# EAGLE design KramerMC_BS1k_ferryTALE2020 (EAGLE 6.6.0)

## Sheet 1 of 2: BWS
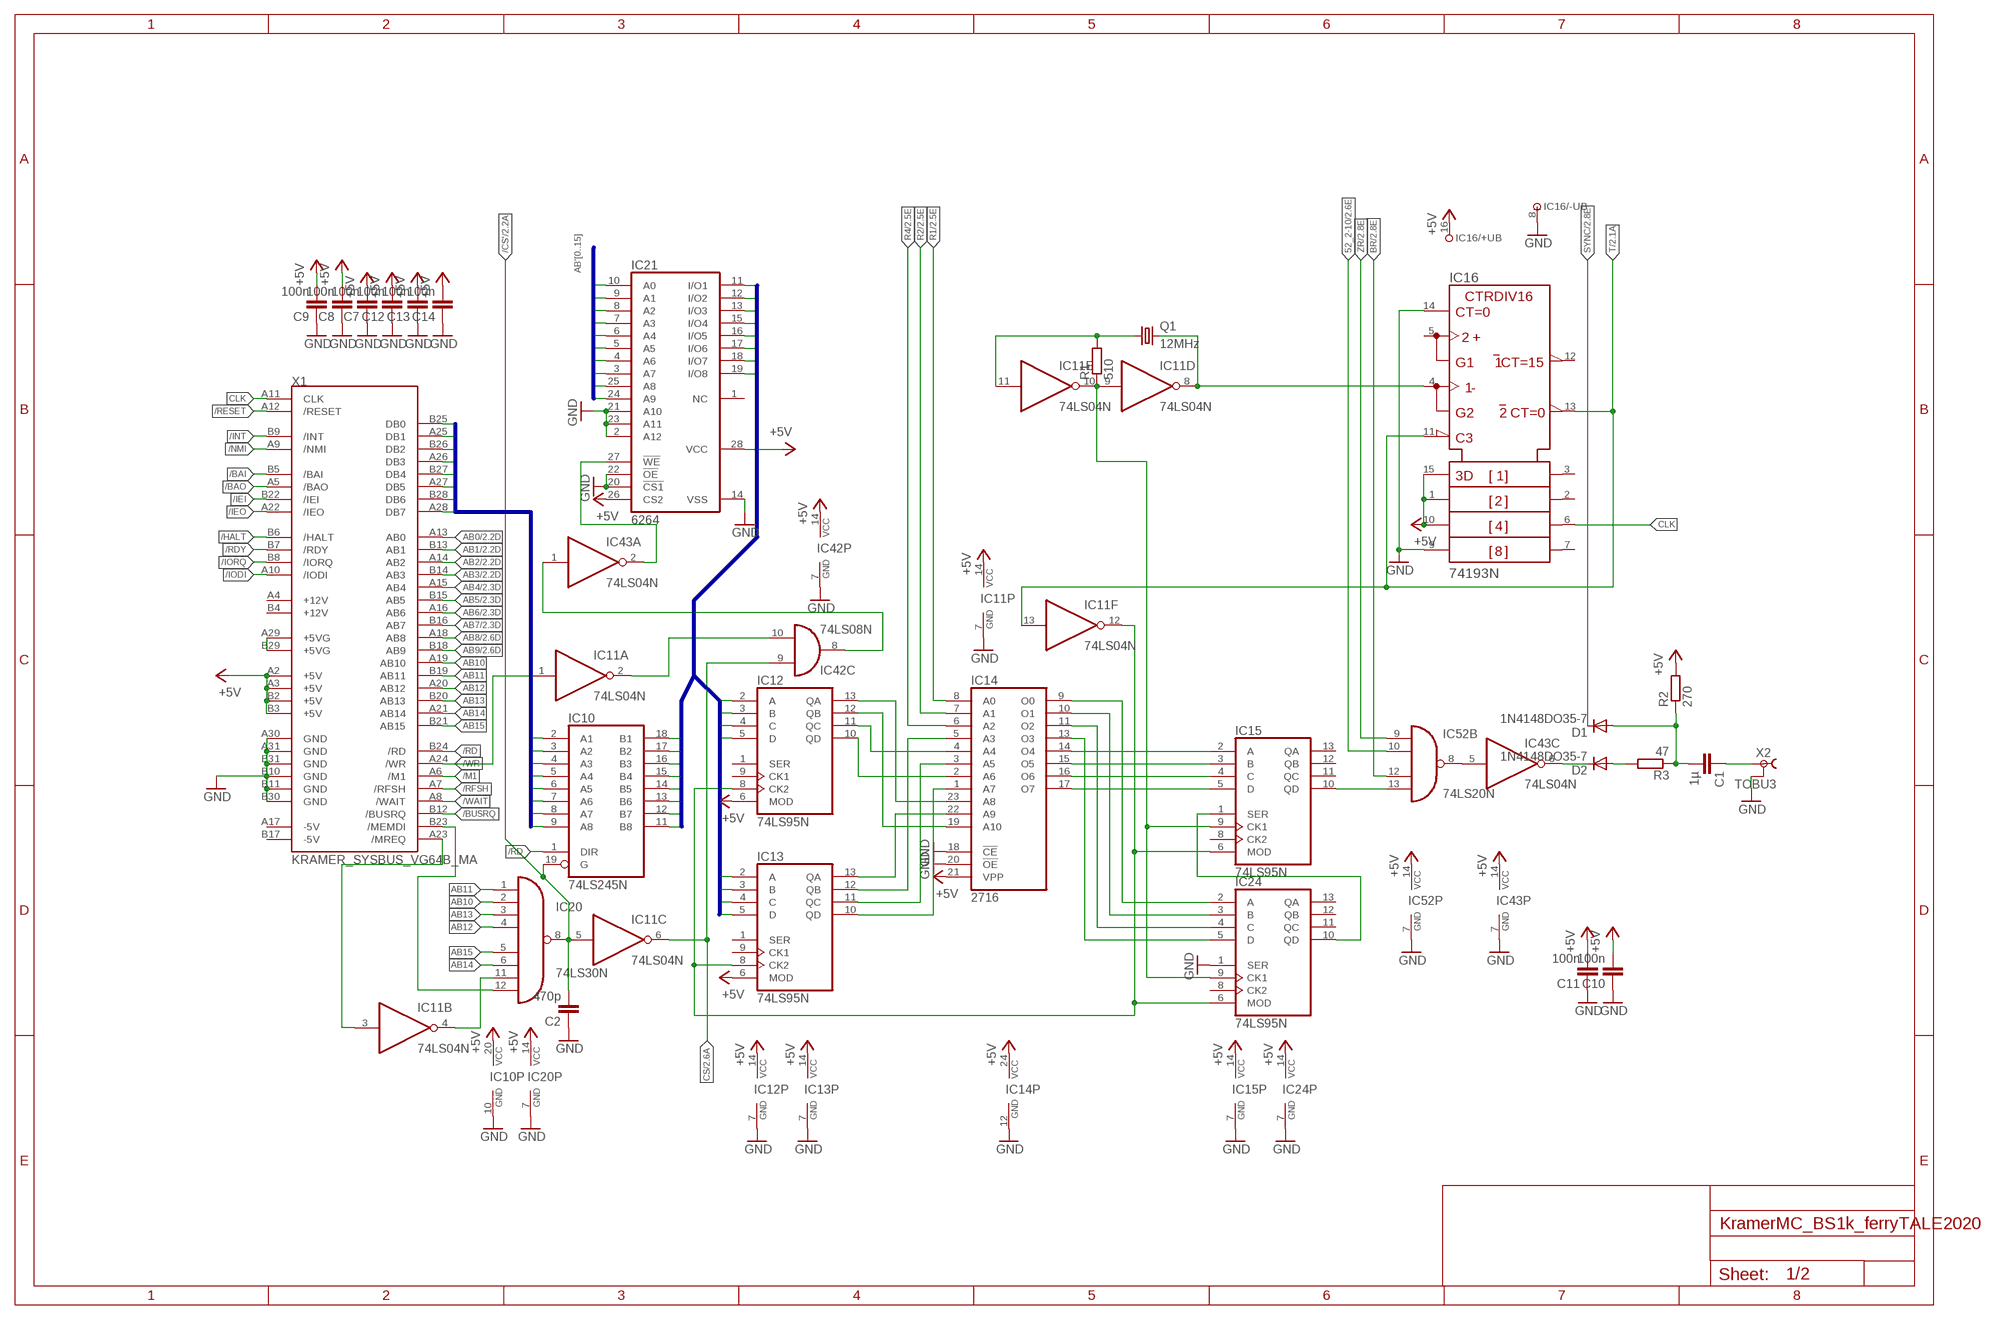
[diagram p0: schematic, sheet 1]

### Parts
C1  1µ  C-EUC0805_WIDE  [C0805_WIDE]
C2  470p  C-EUC0805_WIDE  [C0805_WIDE]
C7  100n  C-EU050-024X044  [C050-024X044]
C8  100n  C-EU050-024X044  [C050-024X044]
C9  100n  C-EU050-024X044  [C050-024X044]
C10  100n  C-EU050-024X044  [C050-024X044]
C11  100n  C-EU050-024X044  [C050-024X044]
C12  100n  C-EU050-024X044  [C050-024X044]
C13  100n  C-EU050-024X044  [C050-024X044]
C14  100n  C-EU050-024X044  [C050-024X044]
D1  1N4148DO35-7  [DO35-7]
D2  1N4148DO35-7  [DO35-7]
IC10  74LS245N  [DIL20]
IC11  74LS04N  [DIL14]
IC12  74LS95N  [DIL14]
IC13  74LS95N  [DIL14]
IC14  2716  [DIL24]
IC15  74LS95N  [DIL14]
IC16  74193N  [DIL16]
IC20  74LS30N  [DIL14]
IC21  6264  6264A  [DIL28-6]
IC24  74LS95N  [DIL14]
IC42  74LS08N  [DIL14]
IC43  74LS04N  [DIL14]
IC52  74LS20N  [DIL14]
Q1  12MHz  CRYSTALHC49S  [HC49/S]
R1  510  R-EU_R0805_WIDE  [R0805_WIDE]
R2  270  R-EU_0207/10  [0207/10]
R3  47  R-EU_0207/2V  [0207/2V]
X1  KRAMER_SYSBUS_VG64B_MA  [MAB64]
X2  TOBU3  [TOBU3]

### Nets
52_2-10: IC52.10(B:I1) ; also sheet 2
+5V: C7.2 C8.2 C9.2 C10.2 C11.2 C12.2 C13.2 C14.2 IC10.20(VCC) IC11.14(P:VCC) IC12.6(MOD) IC12.14(VCC) IC13.6(MOD) IC13.14(VCC) IC14.21(VPP) IC14.24(VCC) IC15.14(VCC) IC16.1(B) IC16.10(C) IC16.15(A) IC16.16(+UB) IC20.14(VCC) IC21.26(CS2) IC21.28(VCC) IC24.14(VCC) IC42.14(P:VCC) IC43.14(P:VCC) IC52.14(P:VCC) R2.2 X1.A2(+5V) X1.A3(+5V) X1.B2(+5V) X1.B3(+5V) ; also sheet 2
+5VG: X1.A29(+5VG) X1.B29(+5VG)
/BAI: X1.B5(/BAI)
/BAO: X1.A5(/BAO)
/BUSRQ: X1.B12(/BUSRQ)
/CS': C2.2 IC10.19(G) IC11.5(C:I) IC20.8(O) ; also sheet 2
/HALT: X1.B6(/HALT)
/IEI: X1.B22(/IEI)
/IEO: X1.A22(/IEO)
/INT: X1.B9(/INT)
/IODI: X1.A10(/IODI)
/IORQ: X1.B8(/IORQ)
/M1: X1.A6(/M1)
/MEMDI: IC20.12(I7) X1.B23(/MEMDI)
/MREQ: IC11.3(B:I) X1.A23(/MREQ)
/NMI: X1.A9(/NMI)
/RD: IC10.1(DIR) X1.B24(/RD)
/RDY: X1.B7(/RDY)
/RESET: X1.A12(/RESET)
/RFSH: X1.A7(/RFSH)
/WAIT: X1.A8(/WAIT)
/WR: IC11.1(A:I) X1.A24(/WR)
AB0: X1.A13(AB0) ; also sheet 2
AB1: X1.B13(AB1) ; also sheet 2
AB2: X1.A14(AB2) ; also sheet 2
AB3: X1.B14(AB3) ; also sheet 2
AB4: X1.A15(AB4) ; also sheet 2
AB5: X1.B15(AB5) ; also sheet 2
AB6: X1.A16(AB6) ; also sheet 2
AB7: X1.B16(AB7) ; also sheet 2
AB8: X1.A18(AB8) ; also sheet 2
AB9: X1.B18(AB9) ; also sheet 2
AB10: IC20.2(I1) X1.A19(AB10)
AB11: IC20.1(I0) X1.B19(AB11)
AB12: IC20.4(I3) X1.A20(AB12)
AB13: IC20.3(I2) X1.B20(AB13)
AB14: IC20.6(I5) X1.A21(AB14)
AB15: IC20.5(I4) X1.B21(AB15)
AB'0: IC21.10(A0) ; also sheet 2
AB'1: IC21.9(A1) ; also sheet 2
AB'2: IC21.8(A2) ; also sheet 2
AB'3: IC21.7(A3) ; also sheet 2
AB'4: IC21.6(A4) ; also sheet 2
AB'5: IC21.5(A5) ; also sheet 2
AB'6: IC21.4(A6) ; also sheet 2
AB'7: IC21.3(A7) ; also sheet 2
AB'8: IC21.25(A8) ; also sheet 2
AB'9: IC21.24(A9) ; also sheet 2
BR: IC52.12(B:I2) ; also sheet 2
CLK: IC16.6(QC) X1.A11(CLK)
CS: IC11.6(C:O) IC42.9(C:I0) ; also sheet 2
DB0: IC10.9(A8) X1.B25(DB0)
DB1: IC10.8(A7) X1.A25(DB1)
DB2: IC10.7(A6) X1.B26(DB2)
DB3: IC10.6(A5) X1.A26(DB3)
DB4: IC10.5(A4) X1.B27(DB4)
DB5: IC10.4(A3) X1.A27(DB5)
DB6: IC10.3(A2) X1.B28(DB6)
DB7: IC10.2(A1) X1.A28(DB7)
DB'0: IC10.11(B8) IC13.3(B) IC21.11(I/O1)
DB'1: IC10.12(B7) IC12.4(C) IC21.12(I/O2)
DB'2: IC10.13(B6) IC13.4(C) IC21.13(I/O3)
DB'3: IC10.14(B5) IC12.5(D) IC21.15(I/O4)
DB'4: IC10.15(B4) IC13.5(D) IC21.16(I/O5)
DB'5: IC10.16(B3) IC12.2(A) IC21.17(I/O6)
DB'6: IC10.17(B2) IC13.2(A) IC21.18(I/O7)
DB'7: IC10.18(B1) IC12.3(B) IC21.19(I/O8)
GND: C2.1 C7.1 C8.1 C9.1 C10.1 C11.1 C12.1 C13.1 C14.1 IC10.10(GND) IC11.7(P:GND) IC12.7(GND) IC13.7(GND) IC14.12(GND) IC14.18(!CE) IC14.20(!OE) IC15.7(GND) IC16.8(-UB) IC16.9(D) IC16.14(CLR) IC20.7(GND) IC21.2(A12) IC21.14(VSS) IC21.20(!CS1) IC21.21(A10) IC21.22(!OE) IC21.23(A11) IC24.1(SER) IC24.7(GND) IC42.7(P:GND) IC43.7(P:GND) IC52.7(P:GND) X1.A30(GND) X1.A31(GND) X1.B10(GND) X1.B11(GND) X1.B30(GND) X1.B31(GND) X2.2 X2.2@1 X2.2@2 ; also sheet 2
N$1: IC11.9(D:I) IC11.10(E:O) IC15.9(CK1) IC24.9(CK1) R1.1
N$2: IC11.11(E:I) Q1.1 R1.2
N$3: IC11.8(D:O) IC16.4(DOWN) Q1.2
N$4: IC12.13(QA) IC14.23(A8)
N$5: IC12.12(QB) IC14.19(A10)
N$6: IC12.11(QC) IC14.4(A4)
N$7: IC12.10(QD) IC14.2(A6)
N$8: IC13.13(QA) IC14.22(A9)
N$9: IC13.12(QB) IC14.5(A3)
N$10: IC13.11(QC) IC14.3(A5)
N$11: IC13.10(QD) IC14.1(A7)
N$12: IC14.17(O7) IC15.5(D)
N$13: IC11.2(A:O) IC42.10(C:I1)
N$14: IC42.8(C:O) IC43.1(A:I)
N$15: IC21.27(!WE) IC43.2(A:O)
N$16: IC14.16(O6) IC15.4(C)
N$17: IC14.15(O5) IC15.3(B)
N$18: IC11.4(B:O) IC20.11(I6)
N$19: IC14.14(O4) IC15.2(A)
N$20: IC43.5(C:I) IC52.8(B:O)
N$21: IC14.13(O3) IC24.5(D)
N$22: IC14.11(O2) IC24.4(C)
N$23: IC14.10(O1) IC24.3(B)
N$24: IC14.9(O0) IC24.2(A)
N$25: IC15.1(SER) IC24.10(QD)
N$27: IC11.12(F:O) IC12.8(CK2) IC13.8(CK2) IC15.6(MOD) IC24.6(MOD)
N$28: C1.2 D1.A R2.1 R3.1
N$29: IC15.10(QD) IC52.13(B:I3)
N$30: C1.1 X2.1
N$31: D2.A R3.2
N$32: D2.C IC43.6(C:O)
R1: IC14.8(A0) ; also sheet 2
R2: IC14.7(A1) ; also sheet 2
R4: IC14.6(A2) ; also sheet 2
SYNC: D1.C ; also sheet 2
T: IC11.13(F:I) IC16.11(!LOAD) IC16.13(!BO) ; also sheet 2
ZR: IC52.9(B:I0) ; also sheet 2
Unconnected: IC12.1(SER) IC12.9(CK1) IC13.1(SER) IC13.9(CK1) IC15.8(CK2) IC15.11(QC) IC15.12(QB) IC15.13(QA) IC16.2(QB) IC16.3(QA) IC16.5(UP) IC16.7(QD) IC16.12(!CO) IC21.1(NC) IC24.8(CK2) IC24.11(QC) IC24.12(QB) IC24.13(QA) X1.A4(+12V) X1.A17(-5V) X1.B4(+12V) X1.B17(-5V)

### Buses
DB[0..7]
DB'[0..7]
AB'[0..15]

## Sheet 2 of 2: Zeitbasis
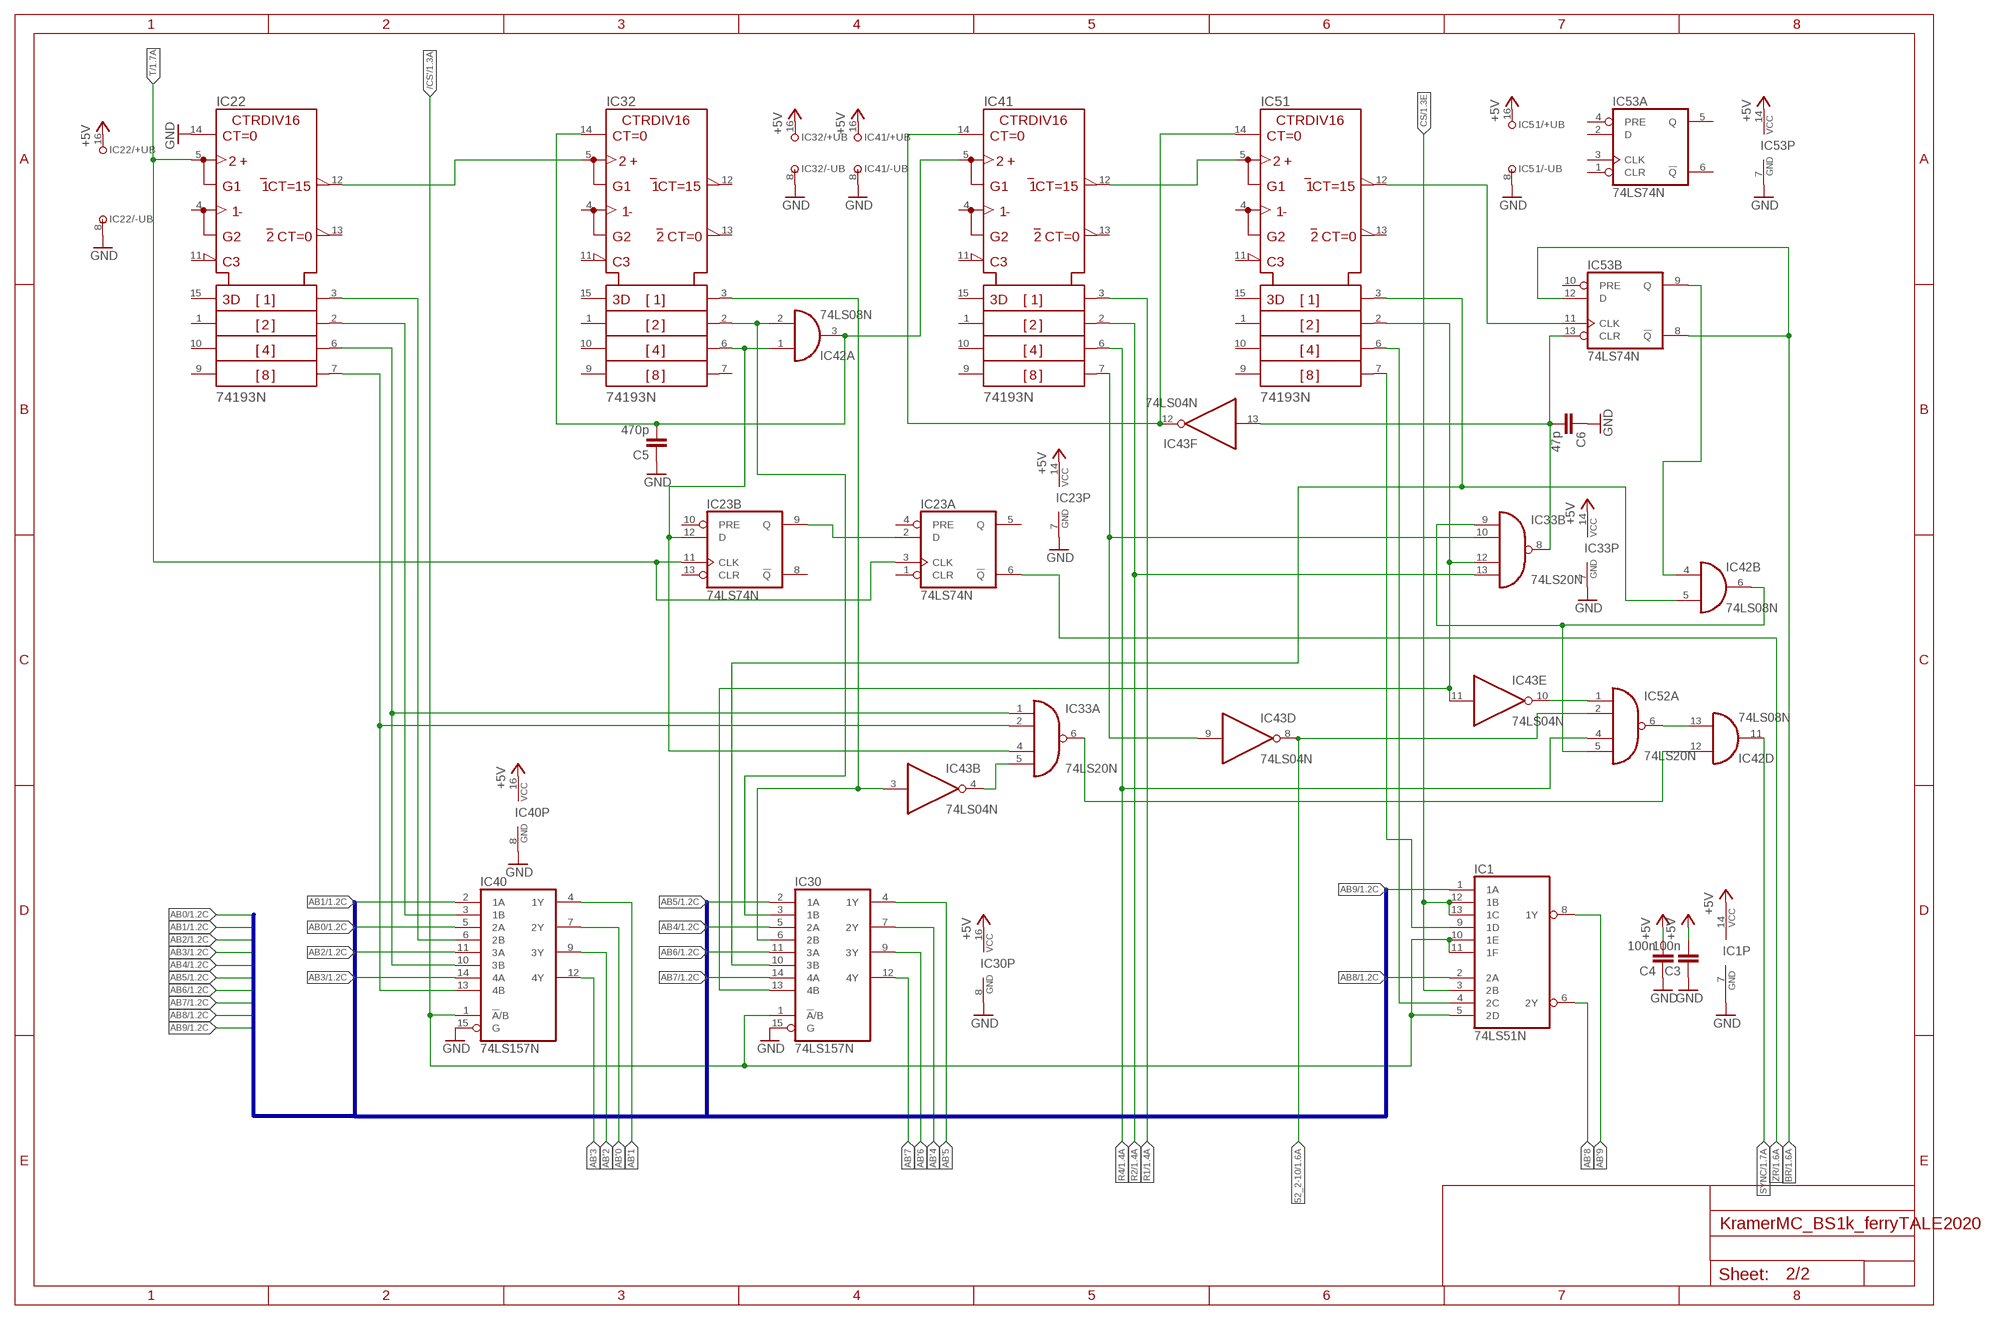
[diagram p1: schematic, sheet 2]

### Parts
C3  100n  C-EU050-024X044  [C050-024X044]
C4  100n  C-EU050-024X044  [C050-024X044]
C5  470p  C-EU050-024X044  [C050-024X044]
C6  47p  C-EU050-024X044  [C050-024X044]
IC1  74LS51N  [DIL14]
IC22  74193N  [DIL16]
IC23  74LS74N  [DIL14]
IC30  74LS157N  [DIL16]
IC32  74193N  [DIL16]
IC33  74LS20N  [DIL14]
IC40  74LS157N  [DIL16]
IC41  74193N  [DIL16]
IC51  74193N  [DIL16]
IC53  74LS74N  [DIL14]

### Nets
52_2-10: IC43.8(D:O) IC52.2(A:I1) ; also sheet 1
+5V: C3.2 C4.2 IC1.14(VCC) IC22.16(+UB) IC23.14(P:VCC) IC30.16(VCC) IC32.16(+UB) IC33.14(P:VCC) IC40.16(VCC) IC41.16(+UB) IC51.16(+UB) IC53.14(P:VCC) ; also sheet 1
/CS': IC1.5(2D) IC1.10(1E) IC1.11(1F) IC30.1(!A!/B) IC40.1(!A!/B) ; also sheet 1
AB0: IC40.5(2A) ; also sheet 1
AB1: IC40.2(1A) ; also sheet 1
AB2: IC40.11(3A) ; also sheet 1
AB3: IC40.14(4A) ; also sheet 1
AB4: IC30.5(2A) ; also sheet 1
AB5: IC30.2(1A) ; also sheet 1
AB6: IC30.11(3A) ; also sheet 1
AB7: IC30.14(4A) ; also sheet 1
AB8: IC1.2(2A) ; also sheet 1
AB9: IC1.1(1A) ; also sheet 1
AB'0: IC40.7(2Y) ; also sheet 1
AB'1: IC40.4(1Y) ; also sheet 1
AB'2: IC40.9(3Y) ; also sheet 1
AB'3: IC40.12(4Y) ; also sheet 1
AB'4: IC30.7(2Y) ; also sheet 1
AB'5: IC30.4(1Y) ; also sheet 1
AB'6: IC30.9(3Y) ; also sheet 1
AB'7: IC30.12(4Y) ; also sheet 1
AB'8: IC1.6(2Y) ; also sheet 1
AB'9: IC1.8(1Y) ; also sheet 1
BR: IC53.8(B:!Q) IC53.12(B:D) ; also sheet 1
CS: IC1.3(2B) IC1.12(1B) IC1.13(1C) ; also sheet 1
GND: C3.1 C4.1 C5.1 C6.1 IC1.7(GND) IC22.8(-UB) IC22.14(CLR) IC23.7(P:GND) IC30.8(GND) IC30.15(G) IC32.8(-UB) IC33.7(P:GND) IC40.8(GND) IC40.15(G) IC41.8(-UB) IC51.8(-UB) IC53.7(P:GND) ; also sheet 1
N$26: IC22.3(QA) IC40.6(2B)
N$33: IC22.2(QB) IC40.3(1B)
N$34: IC22.6(QC) IC33.1(A:I0) IC40.10(3B)
N$35: IC22.7(QD) IC33.2(A:I1) IC40.13(4B)
N$36: IC22.12(!CO) IC32.5(UP)
N$37: C5.2 IC32.14(CLR) IC41.5(UP) IC42.3(A:O)
N$38: IC23.12(B:D) IC32.6(QC) IC33.4(A:I2) IC42.1(A:I0)
N$39: IC30.3(1B) IC32.2(QB) IC42.2(A:I1)
N$40: IC30.6(2B) IC32.3(QA) IC43.3(B:I)
N$41: IC33.5(A:I3) IC43.4(B:O)
N$42: IC23.2(A:D) IC23.9(B:Q)
N$43: IC41.12(!CO) IC51.5(UP)
N$44: IC41.14(CLR) IC43.12(F:O) IC51.14(CLR)
N$45: C6.2 IC33.8(B:O) IC43.13(F:I) IC53.13(B:CLR)
N$46: IC33.10(B:I1) IC41.7(QD) IC43.9(D:I)
N$47: IC33.9(B:I0) IC42.6(B:O) IC52.5(A:I3)
N$48: IC51.12(!CO) IC53.11(B:CLK)
N$49: IC30.10(3B) IC42.5(B:I1) IC51.3(QA)
N$51: IC30.13(4B) IC33.12(B:I2) IC43.11(E:I) IC51.2(QB)
N$52: IC42.4(B:I0) IC53.9(B:Q)
N$53: IC1.4(2C) IC51.6(QC)
N$54: IC1.9(1D) IC51.7(QD)
N$55: IC42.13(D:I1) IC52.6(A:O)
N$56: IC43.10(E:O) IC52.1(A:I0)
N$57: IC33.6(A:O) IC42.12(D:I0)
R1: IC41.3(QA) ; also sheet 1
R2: IC33.13(B:I3) IC41.2(QB) ; also sheet 1
R4: IC41.6(QC) IC52.4(A:I2) ; also sheet 1
SYNC: IC42.11(D:O) ; also sheet 1
T: IC22.5(UP) IC23.3(A:CLK) IC23.11(B:CLK) ; also sheet 1
ZR: IC23.6(A:!Q) ; also sheet 1
Unconnected: IC22.1(B) IC22.4(DOWN) IC22.9(D) IC22.10(C) IC22.11(!LOAD) IC22.13(!BO) IC22.15(A) IC23.1(A:CLR) IC23.4(A:PRE) IC23.5(A:Q) IC23.8(B:!Q) IC23.10(B:PRE) IC23.13(B:CLR) IC32.1(B) IC32.4(DOWN) IC32.7(QD) IC32.9(D) IC32.10(C) IC32.11(!LOAD) IC32.12(!CO) IC32.13(!BO) IC32.15(A) IC41.1(B) IC41.4(DOWN) IC41.9(D) IC41.10(C) IC41.11(!LOAD) IC41.13(!BO) IC41.15(A) IC51.1(B) IC51.4(DOWN) IC51.9(D) IC51.10(C) IC51.11(!LOAD) IC51.13(!BO) IC51.15(A) IC53.1(A:CLR) IC53.2(A:D) IC53.3(A:CLK) IC53.4(A:PRE) IC53.5(A:Q) IC53.6(A:!Q) IC53.10(B:PRE)

### Buses
AB[0..15]

## Library data of the parts
C1-C14 = rcl:C-EU: CAPACITOR, European symbol
D1 D2 = diode:1N4148: DIODE high speed (Philips)
IC1 = 74xx-us:74*51: AND-OR-INVERT gates/for S-type see 74S51 <DEVICE:74S51>
IC10 = 74xx-eu:74*245: Octal BUS TRANSCEIVER, 3-state
IC11 IC43 = 74xx-eu:74*04: Hex INVERTER
IC12 IC13 IC15 IC24 = 74xx-eu:74*95: 4-bit parallel access SHIFT REGISTER
IC14 = memory:2716: MEMORY
IC16 IC22 IC32 IC41 IC51 = 74ttl-din:74*193: Synchronus 4-bit up down COUNTER
IC20 = 74xx-eu:74*30: 8-input NAND gate
IC21 = memory-hitachi:6264A: MEMORY; OC_FARNELL: 283605; OC_NEWARK: unknown
IC23 IC53 = 74xx-eu:74*74: Dual D type positive edge triggered FLIP FLOP, preset and clear
IC30 IC40 = 74xx-eu:74*157: Quadruple 2-line to 1-line data SELECTOR/MULTIPLEXER
IC33 IC52 = 74xx-eu:74*20: Dual 4-input NAND gate
IC42 = 74xx-eu:74*08: Quad 2-input AND gate
Q1 = crystal:CRYSTAL: CRYSTAL; OC_FARNELL: 1667008; OC_NEWARK: unknown
R1-R3 = rcl:R-EU_: RESISTOR, European symbol
X1 = ferry_Kramer_KC:KRAMER_SYSBUS: Kramer Kleincomputer System-Bus Buchse (auf den Modulen verwenden)
X2 = con-hirschmann:TOBU3: Female Cinch CONNECTOR ( RCA Jack ); MF: FARNELL; MPN: TOBU 3; OC_FARNELL: 592791; OC_NEWARK: 06WX5914

## Board
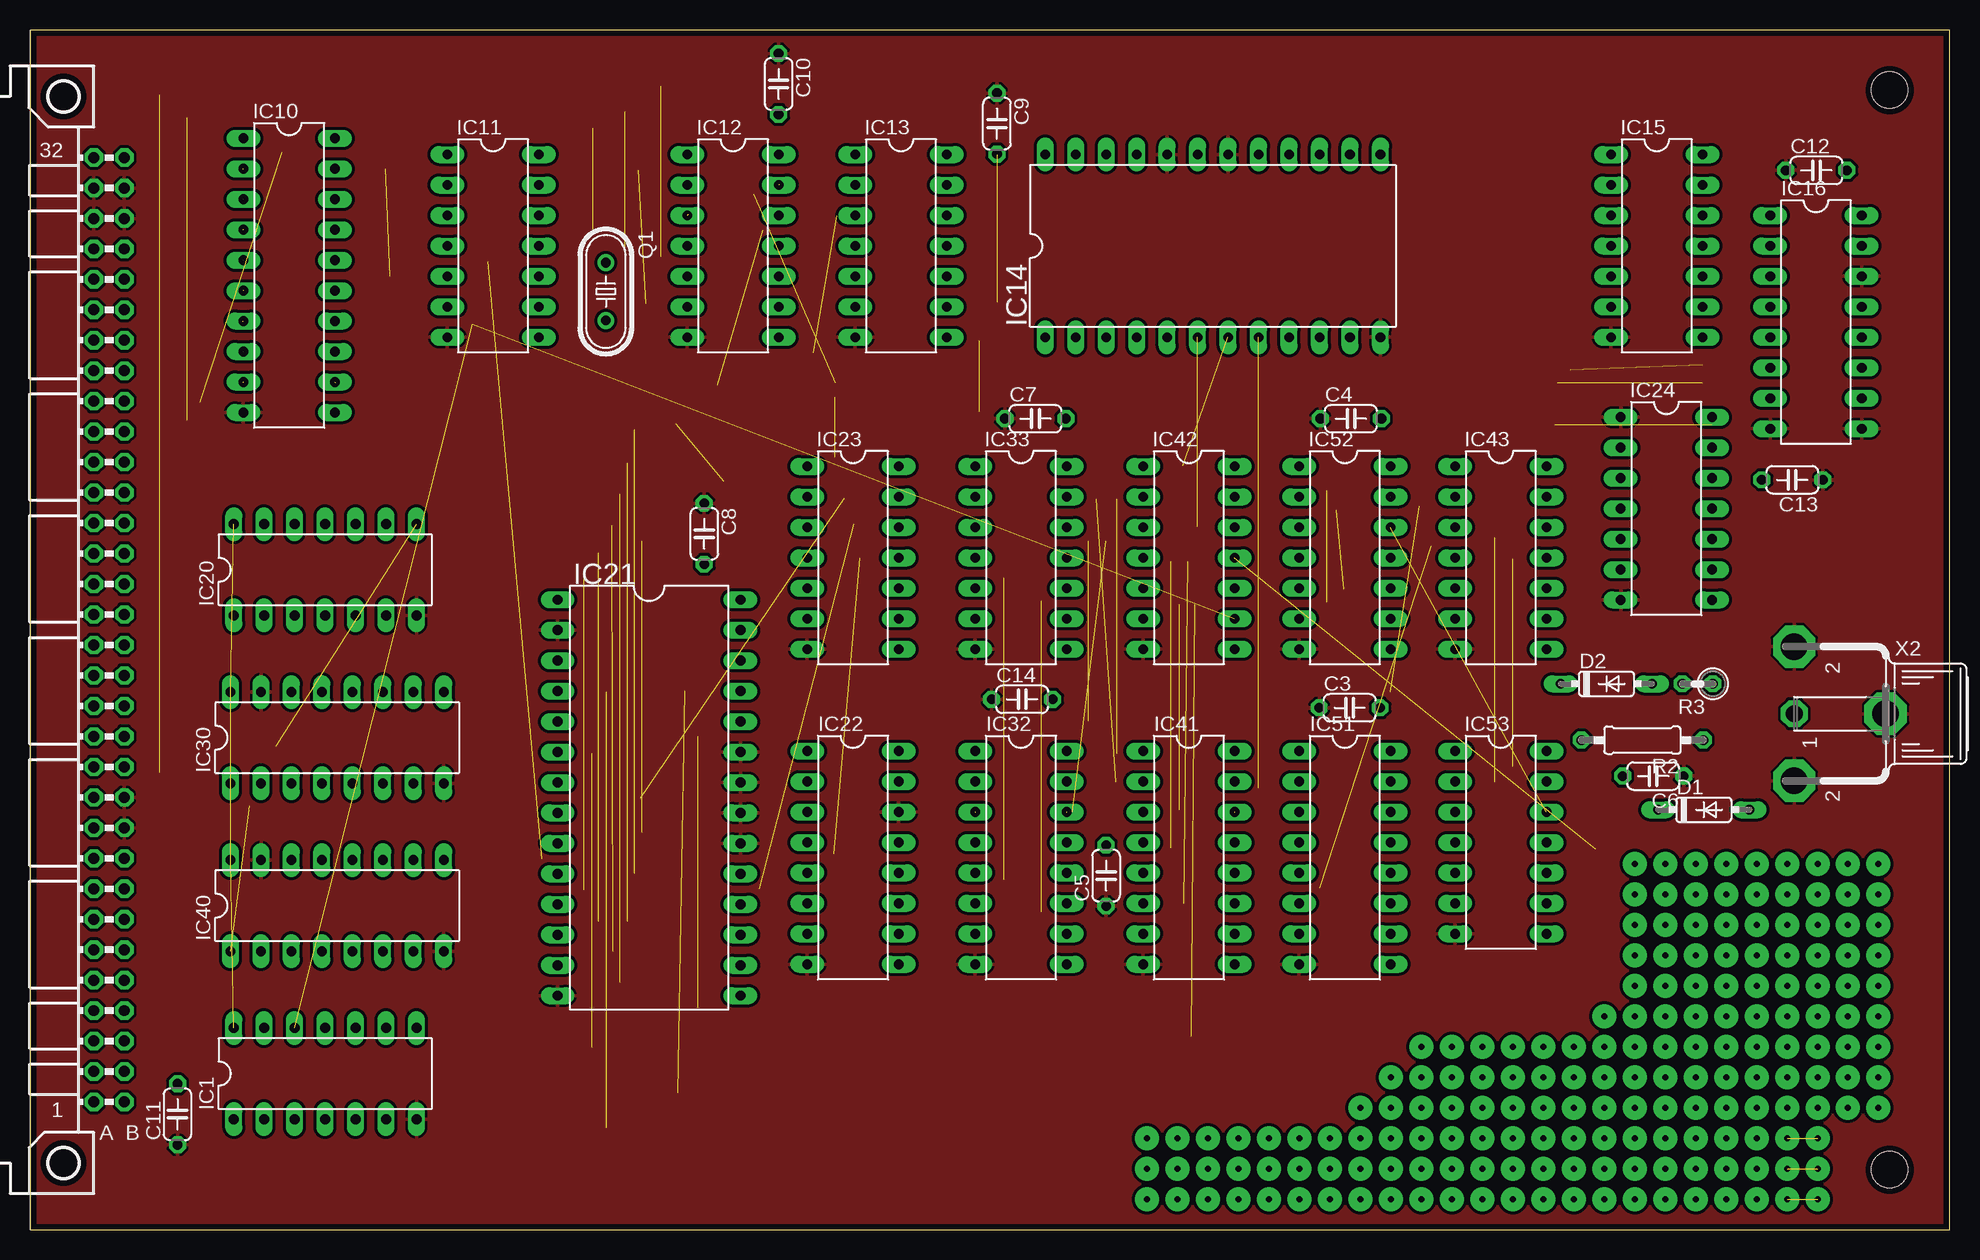
[diagram p2: board, top side]
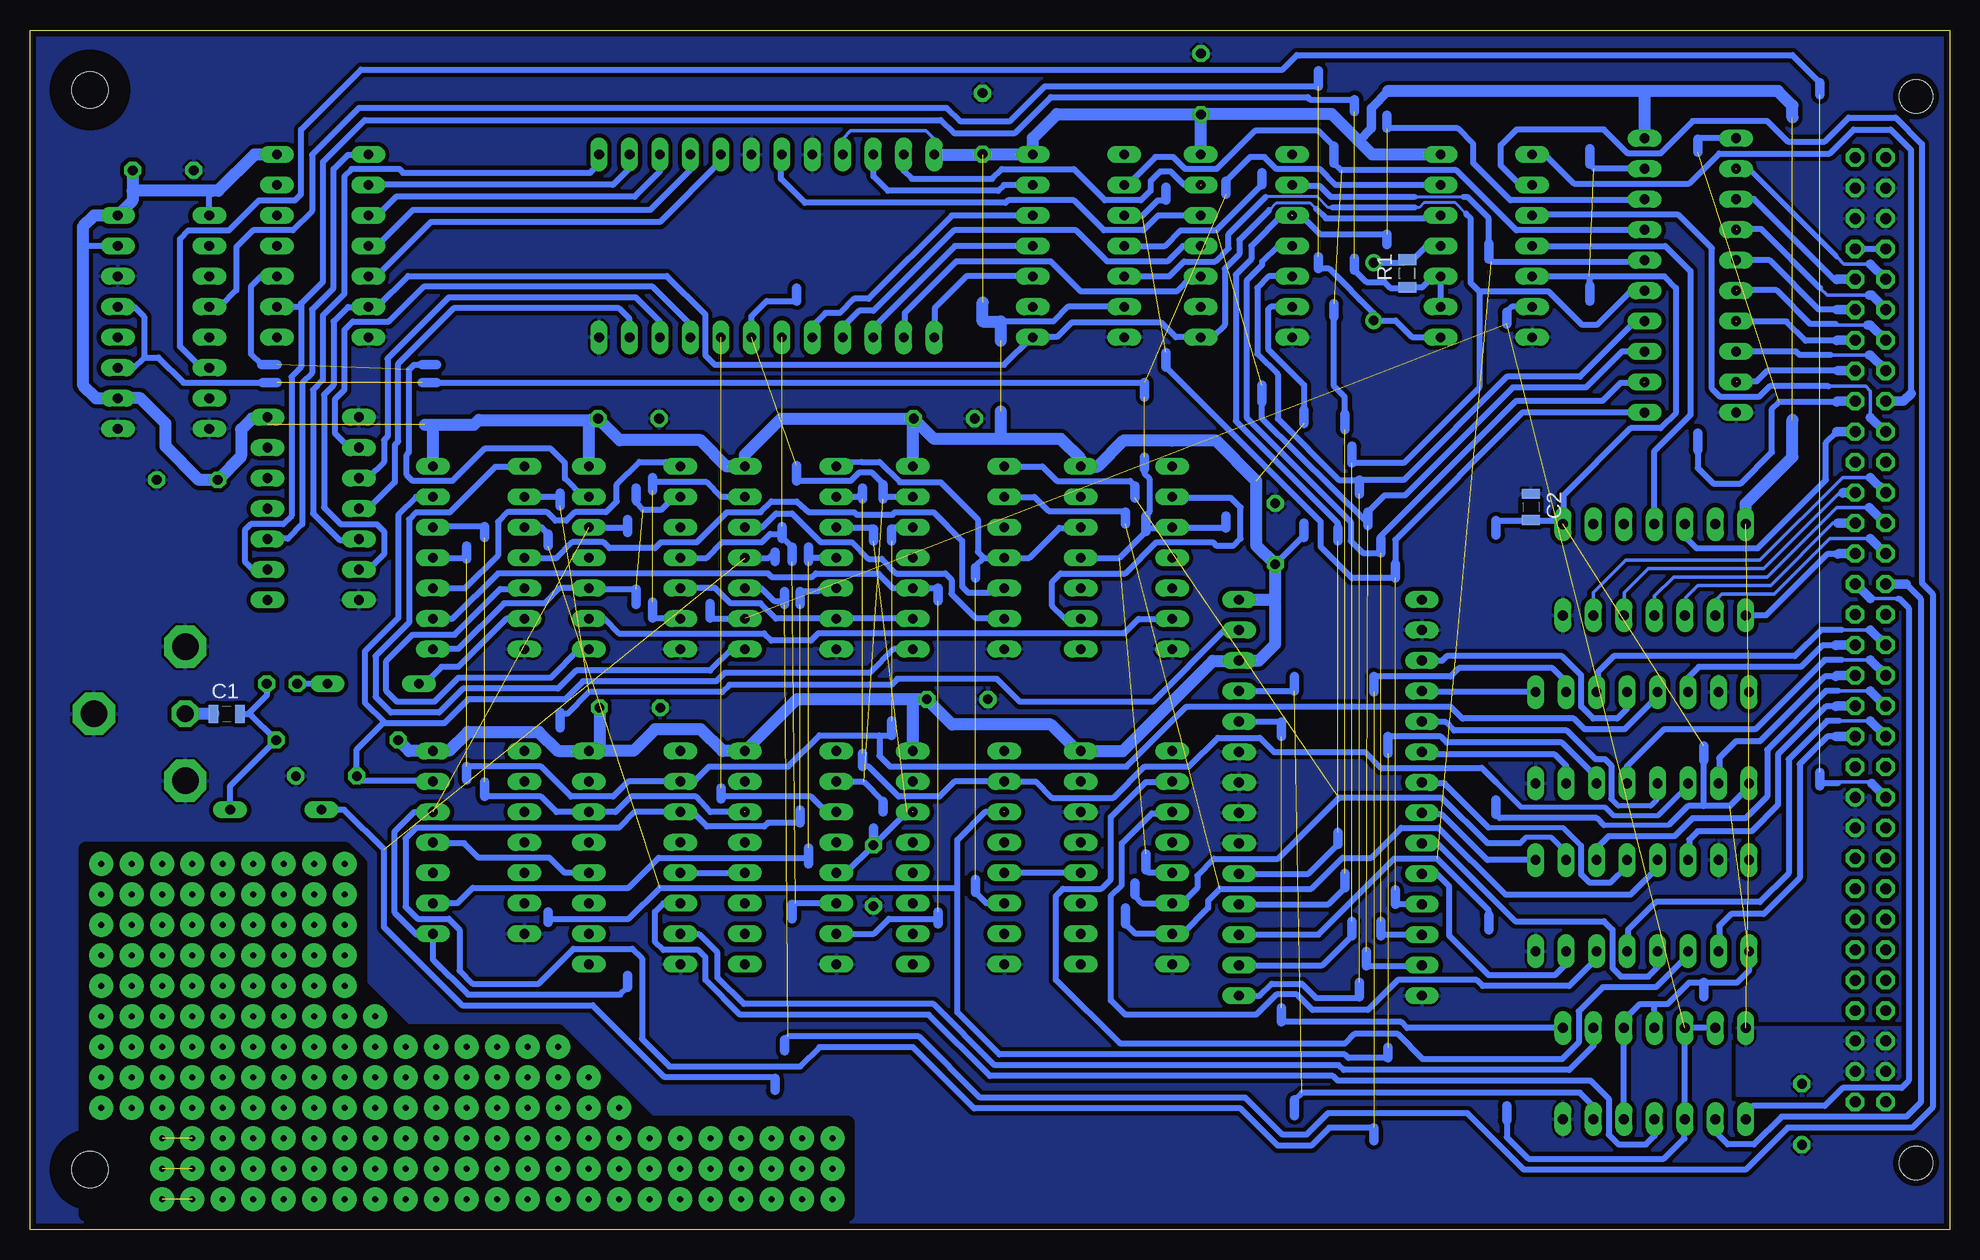
[diagram p3: board, bottom side, seen from below]

Size 160 x 100 mm. Coordinates in mm from the lower left corner, seen from the top.
Outline: 0,0 160,0 160,100 0,100 0,0
Copper layers (1*16): Top 0.035mm / dielectric 1.5mm / Bottom 0.035mm
Design rules "ferry_home *": minimum track width 0.15mm, minimum drill 0.3mm, track to track 0.25mm, track to pad 0.25mm, pad to pad 0.25mm, via to via 0.25mm, smd to smd 0.25mm, copper to edge 0.5mm, drill to drill 0.2mm, minimum pad ring 0.3mm, minimum via ring 0.3mm, stop-mask expansion 0.075mm, vias tented up to drill 0mil, thermal gap 0.2mm
Holes 3 mm at 155,95 155,5
bRestrict: area 152,92 to 158,98; area 152,2 to 158,8; area 91.8,1.3 to 155.3,31.8

### Footprints (pad centres in the part's own frame; a part is rotated, then mirrored left to right if it is on the bottom)
C0805_WIDE = smd 0.8 x 1.5: 1 -1.1,0; 2 1.1,0
C050-024X044 = drill 0.813 octagon: 1 -2.54,0; 2 2.54,0
DO35-7 = drill 0.813 long: A 3.81,0; C -3.81,0
DIL14 = drill 0.813 long: 1 -7.62,-3.81; 2 -5.08,-3.81; 3 -2.54,-3.81; 4 0,-3.81; 5 2.54,-3.81; 6 5.08,-3.81; 7 7.62,-3.81; 8 7.62,3.81; 9 5.08,3.81; 10 2.54,3.81; 11 0,3.81; 12 -2.54,3.81; 13 -5.08,3.81; 14 -7.62,3.81
DIL20 = drill 0.813 long: 1 -11.43,-3.81; 2 -8.89,-3.81; 3 -6.35,-3.81; 4 -3.81,-3.81; 5 -1.27,-3.81; 6 1.27,-3.81; 7 3.81,-3.81; 8 6.35,-3.81; 9 8.89,-3.81; 10 11.43,-3.81; 11 11.43,3.81; 12 8.89,3.81; 13 6.35,3.81; 14 3.81,3.81; 15 1.27,3.81; 16 -1.27,3.81; 17 -3.81,3.81; 18 -6.35,3.81; 19 -8.89,3.81; 20 -11.43,3.81
DIL24 = drill 0.813 long: 1 -13.97,-7.62; 2 -11.43,-7.62; 3 -8.89,-7.62; 4 -6.35,-7.62; 5 -3.81,-7.62; 6 -1.27,-7.62; 7 1.27,-7.62; 8 3.81,-7.62; 9 6.35,-7.62; 10 8.89,-7.62; 11 11.43,-7.62; 12 13.97,-7.62; 13 13.97,7.62; 14 11.43,7.62; 15 8.89,7.62; 16 6.35,7.62; 17 3.81,7.62; 18 1.27,7.62; 19 -1.27,7.62; 20 -3.81,7.62; 21 -6.35,7.62; 22 -8.89,7.62; 23 -11.43,7.62; 24 -13.97,7.62
DIL16 = drill 0.813 long: 1 -8.89,-3.81; 2 -6.35,-3.81; 3 -3.81,-3.81; 4 -1.27,-3.81; 5 1.27,-3.81; 6 3.81,-3.81; 7 6.35,-3.81; 8 8.89,-3.81; 9 8.89,3.81; 10 6.35,3.81; 11 3.81,3.81; 12 1.27,3.81; 13 -1.27,3.81; 14 -3.81,3.81; 15 -6.35,3.81; 16 -8.89,3.81
DIL28-6 = drill 0.813 long: 1 -16.51,-7.62; 2 -13.97,-7.62; 3 -11.43,-7.62; 4 -8.89,-7.62; 5 -6.35,-7.62; 6 -3.81,-7.62; 7 -1.27,-7.62; 8 1.27,-7.62; 9 3.81,-7.62; 10 6.35,-7.62; 11 8.89,-7.62; 12 11.43,-7.62; 13 13.97,-7.62; 14 16.51,-7.62; 15 16.51,7.62; 16 13.97,7.62; 17 11.43,7.62; 18 8.89,7.62; 19 6.35,7.62; 20 3.81,7.62; 21 1.27,7.62; 22 -1.27,7.62; 23 -3.81,7.62; 24 -6.35,7.62; 25 -8.89,7.62; 26 -11.43,7.62; 27 -13.97,7.62; 28 -16.51,7.62
HC49/S = drill 0.813: 1 -2.413,0; 2 2.413,0
R0805_WIDE = smd 0.9 x 1.5: 1 -1.15,0; 2 1.15,0
0207/10 = drill 0.813 octagon: 1 -5.08,0; 2 5.08,0
0207/2V = drill 0.813 octagon: 1 -1.27,0; 2 1.27,0
MAB64 = drill 0.914 octagon: A1 39.37,-1.27; A2 36.83,-1.27; A3 34.29,-1.27; A4 31.75,-1.27; A5 29.21,-1.27; A6 26.67,-1.27; A7 24.13,-1.27; A8 21.59,-1.27; A9 19.05,-1.27; A10 16.51,-1.27; A11 13.97,-1.27; A12 11.43,-1.27; A13 8.89,-1.27; A14 6.35,-1.27; A15 3.81,-1.27; A16 1.27,-1.27; A17 -1.27,-1.27; A18 -3.81,-1.27; A19 -6.35,-1.27; A20 -8.89,-1.27; A21 -11.43,-1.27; A22 -13.97,-1.27; A23 -16.51,-1.27; A24 -19.05,-1.27; A25 -21.59,-1.27; A26 -24.13,-1.27; A27 -26.67,-1.27; A28 -29.21,-1.27; A29 -31.75,-1.27; A30 -34.29,-1.27; A31 -36.83,-1.27; A32 -39.37,-1.27; B1 39.37,1.27; B2 36.83,1.27; B3 34.29,1.27; B4 31.75,1.27; B5 29.21,1.27; B6 26.67,1.27; B7 24.13,1.27; B8 21.59,1.27; B9 19.05,1.27; B10 16.51,1.27; B11 13.97,1.27; B12 11.43,1.27; B13 8.89,1.27; B14 6.35,1.27; B15 3.81,1.27; B16 1.27,1.27; B17 -1.27,1.27; B18 -3.81,1.27; B19 -6.35,1.27; B20 -8.89,1.27; B21 -11.43,1.27; B22 -13.97,1.27; B23 -16.51,1.27; B24 -19.05,1.27; B25 -21.59,1.27; B26 -24.13,1.27; B27 -26.67,1.27; B28 -29.21,1.27; B29 -31.75,1.27; B30 -34.29,1.27; B31 -36.83,1.27; B32 -39.37,1.27 | hole 2.794: 44.45,-3.81; -44.45,-3.81
TOBU3 = drill 1.397 octagon: 1 0,-2.54 | drill 2.21 octagon: 2 5.588,-2.54; 2@1 -5.588,-2.54; 2@2 0,5.08

### Placement (x,y rotation side)
C1  143.6,43 0 bottom
C2  34.89,60.25 270 bottom
C3  110,43.5 0 top
C4  110.1,67.6 0 top
C5  89.7,29.5 90 top
C6  135.3,37.8 180 top
C7  83.8,67.6 0 top
C8  56.2,58 270 top
C9  80.6,92.2 270 top
C10  62.4,95.5 270 top
C11  12.3,9.6 90 top
C12  148.9,88.3 0 top
C13  146.9,62.5 180 top
C14  82.7,44.2 0 top
D1  139.51,35 0 top
D2  131.4,45.5 0 top
IC1  24.6,13 0 top
IC10  21.6,79.54 270 top
IC11  38.6,82 270 top
IC12  58.6,82 270 top
IC13  72.6,82 270 top
IC14  98.6,82 0 top
IC15  135.6,82 270 top
IC16  148.87,75.65 270 top
IC20  24.6,55 0 top
IC21  51.6,36 270 top
IC22  68.6,31 270 top
IC23  68.6,56 270 top
IC24  136.4,60.1 270 top
IC30  25.6,41 0 top
IC32  82.6,31 270 top
IC33  82.6,56 270 top
IC40  25.6,27 0 top
IC41  96.6,31 270 top
IC42  96.6,56 270 top
IC43  122.6,56 270 top
IC51  109.6,31 270 top
IC52  109.6,56 270 top
IC53  122.6,32.27 270 top
Q1  48,78.2 270 top
R1  45.2,79.7 90 bottom
R2  134.4,40.8 180 top
R3  139,45.5 180 top
X1  6.6,50 270 top
X2  149.6,43 270 top

### Tracks (layer width: path | path; a pad name or v marks a point on that pad's centre or on a via)
52_2-10  (1 unrouted)
  Bottom 0.5: IC43.8 126.39,48.4 124.3,48.4 120.5,52.2 117.1,52.2 115.84,53.46 IC52.10 113.26,53.46 113.2,53.4 109.5,53.4 | IC52.2 106.32,61.08 107.4,60 108.9,60 109.5,60.6 109.5,60.8
  Bottom 0.8: 109.5,53.4 109.5,52.1 | 109.5,60.8 109.5,61.8
+5V  (8 unrouted)
  Bottom 0: IC24.14 140.21,67.11 140.2,67.1
  Bottom 0.3: IC14.21 92.25,90.95 91.6,91.6 85.3,91.6 84.6,90.9 84.6,89.65 IC14.24
  Bottom 0.5: IC21.28 | IC13.6 73.48,76.92 74.7,75.7 79.1,75.7 | IC12.6 56.58,76.92 56.8,76.7 56.8,73.4 53.8,70.4 53.8,68.3 | 53.8,57.7 53.96,57.7 C8.2 | 25.41,94.81 25.5,94.9 | IC16.1 145.06,86.34 144.8,86.6 | IC16.15 155.5,82 155.6,82.1 | 64.79,65.49 65.1,65.8
  Bottom 0.8: 53.8,67.2 53.8,68.3 | 53.8,58.9 53.8,57.7 | 46.8,94.9 48.2,93.5 48.2,91.8 49.25,90.75
  Bottom 1: IC12.14 62.41,92.73 C10.2 | IC14.24 80.62,89.62 C9.2 80.58,89.62 IC13.14 76.41,90.99 74.4,93 62.44,93 C10.2 | C10.2 62.34,93 51.5,93 49.25,90.75 48.12,89.62 IC11.14 | 113.3,67.5 122.6,67.5 123,67.1 126.4,67.1 | 113.3,67.5 112.74,67.5 C4.2 110.84,65.8 104.1,65.8 101.92,63.62 IC42.14 100.41,64.59 97.4,67.6 C7.2 | IC52.14 113.41,67.39 113.3,67.5 | C12.2 151.44,86.6 | 151.44,86.6 151.44,85.78 IC16.16 154.66,84.54 155.6,83.6 155.6,82.1 155.6,70.4 154.5,69.3 IC16.10 150.8,69.3 148.7,67.2 148.7,65.3 145.9,62.5 C13.2 142.4,64.46 142.4,66.7 141.48,67.62 IC24.14 | IC15.14 141.28,89.62 144.3,86.6 144.8,86.6 151.44,86.6 | 86.1,44.2 C14.2 83.14,42.1 74.9,42.1 72.69,39.89 IC22.16 68.91,39.89 61.4,47.4 59.25,47.4 IC21.26 57.57,47.43 56.2,48.8 56.2,52.21 56.5,52.51 | 86.1,44.2 96.1,44.2 IC41.16 102.29,39.89 104.1,41.7 107.9,41.7 109.7,39.9 112.5,39.9 | IC32.16 86.41,43.89 86.1,44.2 | IC33.14 86.41,67.53 C7.2 | 79.1,65.9 74.1,65.9 72.41,64.21 IC23.14 70.98,63.62 68.8,65.8 65.1,65.8 61.2,65.8 57.8,62.4 57.8,57.06 C8.2 56.2,54.2 56.19,52.51 56.5,52.51 | 79.1,65.9 84.64,65.9 C7.2 | IC21.28 56.5,52.51 | 112.5,39.9 IC51.16 116,39.9 117.6,41.5 123.5,41.5 125.1,39.9 IC53.14 128.41,39.89 R2.2 | C3.2 112.54,39.94 112.5,39.9 | 13.1,67.5 13.1,64.4 16.98,60.52 IC20.14 | 13.1,92.7 13.1,93.7 14.3,94.9 25.1,94.9 | 25.1,94.9 25.5,94.9 46.8,94.9 | 80.6,77.3 80.6,75.7 79.1,75.7 79.1,74.1 | 79.1,68.2 79.1,65.9 | 127.1,67.1 126.4,67.1 | IC43.14 126.41,67.09 126.4,67.1 | IC10.20 25.41,94.59 25.1,94.9
  pour Bottom (isolate 0.35, rank 5): 2.2,11.2 2.2,16.8 17.7,16.8 17.7,11.2
+5VG
  Bottom 0.5: X1.A29 X1.B29
/CS'  (3 unrouted)
  Bottom 0.4: 23.3,33.8 23.4,33.7 28.8,33.7
  Bottom 0.5: IC11.5 30.03,79.46 | 30.03,79.46 23.76,79.46 22.8,78.5 22.8,68.12 22.79,68.11 24.1,66.8 26.6,66.8 32.2,61.2 32.2,58.83 IC20.8 32.51,59.1 35.1,59.1 37.8,59.1 | 24.7,18.8 25.8,18.8 27.14,17.46 IC1.10 IC1.5 | 24.7,18.8 23.5,18.8 21.7,20.6 20.5,20.6 17.7,20.6 16.7,21.6 IC40.1 | IC30.1 16.71,36.89 18.3,35.3 20.5,35.3 | 20.5,35.3 21.8,35.3 23.3,33.8 | 28.8,33.7 29.4,34.3 37.5,34.3 37.8,34.6 | 20.5,35.3 20.5,39.1 | IC10.19 29.63,88.43 30,88.8 | 30.03,79.46 30.03,78.73 30,78.7 | IC1.11 24.6,18.7 24.7,18.8
  Bottom 0.8: 37.8,34.6 37.8,35.8 | 37.8,57.9 37.8,59.1 | C2.2 35.05,59.15 35.1,59.1 | 20.5,39.1 20.5,40.3 | 20.5,19.4 20.5,20.6 | 30,88.8 30,90.1 | 30,78.7 30,77.4
/MEMDI
  Bottom 0.5: IC20.12 22.06,57.76 21.1,56.8 16,56.8 10.3,62.5 10.3,65.6 9.4,66.5
  Bottom 0.8: X1.B23 9.39,66.51 9.4,66.5
/MREQ
  Bottom 0.3: 6.6,67.7 6.6,69.9 7,70.3 10.1,70.3
  Bottom 0.5: 10.1,70.3 15,70.3 15.9,69.4 19.1,69.4 19.8,70.1 19.8,81.8 22.6,84.6 34.73,84.6 IC11.3
  Bottom 0.8: X1.A23 5.41,66.51 6.6,67.7
/RD  (1 unrouted)
  Bottom 0.5: 9.4,69 14.2,69 14.8,68.4 14.8,64.8 17.4,62.2 19.7,62.2 21,63.5 21,65 | IC10.1 20.93,90.97 21,90.9
  Bottom 0.8: X1.B24 9.35,69.05 9.4,69 | 21,90.9 21,89.8 | 21,66.4 21,65
/WR
  Bottom 0.5: 3.2,69.7 3.2,90 4.9,91.7 8,91.7 10,89.7 19.2,89.7 21.7,87.2 31.3,87.2 33.6,89.5 34.6,89.5 34.72,89.62 IC11.1
  Bottom 0.8: X1.A24 3.85,69.05 3.2,69.7
AB0
  Bottom 0.3: 6.6,42.4 9.2,42.4
  Bottom 0.5: 9.2,42.4 10.2,42.4 13.4,39.2 13.4,29.7 15.8,27.3 24.5,27.3 26.8,25 26.8,23.26 IC40.5
  Bottom 0.8: X1.A13 5.33,41.13 6.6,42.4
AB1
  Bottom 0.5: 9.5,41.1 10.2,41.1 12.5,38.8 12.5,29.3 15.5,26.3 18.2,26.3 19.2,25.3 19.2,23.24 IC40.2
  Bottom 0.8: X1.B13 9.49,41.11 9.5,41.1
AB2
  Bottom 0.3: 6.6,44.9 9.3,44.9
  Bottom 0.5: 9.3,44.9 10.3,44.9 15.2,40 15.2,36.1 17,34.3 21.4,34.3 22.9,32.8 28.4,32.8 29.4,31.8 IC40.11
  Bottom 0.8: X1.A14 5.35,43.65 6.6,44.9
AB3
  Bottom 0.5: 9.5,43.6 10.3,43.6 14.3,39.6 14.3,35.4 16.5,33.2 21,33.2 21.7,32.5 21.7,30.9 IC40.14
  Bottom 0.8: X1.B14 9.45,43.65 9.5,43.6
AB4
  Bottom 0.3: 6.6,47.5 9,47.5
  Bottom 0.5: 9,47.5 10.4,47.5 16.2,41.7 23.8,41.7 26.9,38.6 26.9,37.22 IC30.5
  Bottom 0.8: X1.A15 5.33,46.23 6.6,47.5
AB5
  Bottom 0.5: 9.5,46.1 10.4,46.1 15.8,40.7 17.8,40.7 19.2,39.3 19.2,37.24 IC30.2
  Bottom 0.8: X1.B15 9.41,46.19 9.5,46.1
AB6
  Bottom 0.3: 6.6,50 9,50
  Bottom 0.5: 9,50 10.7,50 12.9,47.8 28,47.8 29.3,46.5 29.3,44.92 IC30.11
  Bottom 0.8: X1.A16 6.6,50
AB7
  Bottom 0.5: 9.5,48.7 10.6,48.7 12.4,46.9 20.9,46.9 21.8,46 IC30.14
  Bottom 0.8: X1.B16 9.47,48.73 9.5,48.7
AB8
  Bottom 0.5: 3.6,53.8 2.4,52.6 2.4,10.6 3.6,9.4 14,9.4 16.3,7.1 18.5,7.1 19.5,8.1 19.5,9.17 IC1.2
  Bottom 0.8: X1.A18 3.61,53.81 3.6,53.8
AB9
  Bottom 0.3: 6.6,52.6 4.3,52.6
  Bottom 0.5: 4.3,52.6 4.2,52.6 3.4,51.8 3.4,12.4 4,11.8 8.9,11.8 10.4,10.3 16.4,10.3 16.9,9.8 16.9,9.27 IC1.1
  Bottom 0.8: X1.B18 7.81,53.81 6.6,52.6
AB10
  Bottom 0.3: 6.6,57.6 10,57.6 14.6,53 19,53 19.5,52.5 19.5,51.21 IC20.2
  Bottom 0.8: X1.A19 5.35,56.35 6.6,57.6
AB11
  Bottom 0.5: 9.3,56.3 10.2,56.3 15.3,51.2 IC20.1
  Bottom 0.8: X1.B19 9.25,56.35 9.3,56.3
AB12
  Bottom 0.3: 6.7,60.2 9.4,60.2 15.2,54.4 23,54.4 24.6,52.8 IC20.4
  Bottom 0.8: X1.A20 5.39,58.89 6.7,60.2
AB13
  Bottom 0.3: 9.29,58.89 9.71,58.89 14.9,53.7 21,53.7 22,52.7 22,51.25 IC20.3
  Bottom 0.8: X1.B20 9.29,58.89 9.3,58.9
AB14
  Bottom 0.3: 6.6,62.7 8.9,62.7 15.8,55.8 27,55.8 29.7,53.1 29.7,51.21 IC20.6
  Bottom 0.8: X1.A21 6.6,62.7
AB15
  Bottom 0.3: 8.9,61.4 9.2,61.4 15.5,55.1 25.1,55.1 27.1,53.1 27.1,51.23 IC20.5
  Bottom 0.8: X1.B21 8.87,61.43 8.9,61.4
AB'0
  Bottom 0.5: IC40.7 31.95,22.15 32.9,21.2 38.4,21.2 41.7,24.5 41.7,28.6 42.7,29.6 43.93,29.6 IC21.10
AB'1
  Bottom 0.5: IC21.9 42.69,32.19 36.2,25.7 28.8,25.7 28.1,25 28.1,21.8 27.4,21.1 25.1,21.1 24.3,21.9 24.3,23.16 IC40.4
AB'2
  Bottom 0.5: IC40.9 38.51,30.81 42.3,34.6 43.85,34.6 IC21.8
AB'3
  Bottom 0.4: 30.7,32 32.2,33.5 38.4,33.5
  Bottom 0.5: IC40.12 26.87,30.33 28.3,28.9 30,28.9 30.7,29.6 30.7,32 | 38.4,33.5 42.1,37.2 43.91,37.2 IC21.7
AB'4
  Bottom 0.5: IC30.7 31.95,38.65 32.9,39.6 42.9,39.6 43.1,39.8 IC21.6
AB'5
  Bottom 0.3: 24.4,35.9 24.4,35.8
  Bottom 0.4: 24.4,35.9 24.4,37.12 | 24.4,35.8 24.9,35.3 27.6,35.3 28.2,35.9
  Bottom 0.5: 28.2,35.9 28.2,38.7 28.7,39.2 29.5,39.2 31.9,41.6 41.3,41.6 42,42.3 43.93,42.3 IC21.5 | 24.4,37.12 IC30.4
AB'6
  Bottom 0.5: IC30.9 43.9,44.81 IC21.4
AB'7
  Bottom 0.5: IC30.12 26.87,43.43 27.7,42.6 29.7,42.6 30.7,43.6 30.7,46.2 32.3,47.8 41.9,47.8 42.3,47.4 43.95,47.4 IC21.3
AB'8  (1 unrouted)
  Bottom 0.5: IC21.25 59.01,44.89 59,44.9 54.6,44.9 | IC1.6 29.68,10.28 30.8,11.4 54,11.4 54.6,10.8
  Bottom 0.8: 54.6,46.1 54.6,44.9 | 54.6,10.8 54.6,9.5
AB'9  (1 unrouted)
  Bottom 0.5: IC21.24 55.75,42.35 55.7,42.3 | IC1.8 45.21,16.81 45.7,17.3 55.7,17.3
  Bottom 0.8: 55.7,42.3 55.7,41.1 | 55.7,17.3 55.7,18.5
BR  (1 unrouted)
  Bottom 0.5: IC52.12 110.26,58.54 110.2,59.2 | 110.2,20.2 110.8,19.6 123.5,19.6 126.4,22.5 IC53.8 126.46,24.6 127.8,24.6 129.6,26.4 129.6,33.2 128,34.8 IC53.12
  Bottom 0.8: 110.2,59.2 110.2,58.1 | 110.2,21.2 110.2,20.2
CLK  (1 unrouted)
  Bottom 0.3: 6.5,37.2 6.6,37.3 9.2,37.3 9.3,37.2
  Bottom 0.5: IC16.6 145.74,71.84 147.5,73.6 147.5,82.6 146.8,83.3 143.4,83.3 140.9,85.8 137.9,85.8 137.4,86.3 137.4,91.7 132.4,96.7 55.6,96.7 54.4,97.9 13.1,97.9 10.8,95.6 | 9.3,37.2 10.8,37.2
  Bottom 0.8: 10.8,95.6 10.8,94.6 | 10.8,38.1 10.8,37.2 10.8,37 | X1.A11 6.5,37.2
CS  (2 unrouted)
  Bottom 0.5: IC42.9 100.48,50.92 100.5,50.9 103.3,50.9 103.3,51 | IC11.6 36.48,76.92 36.9,76.5 | IC1.13 IC1.12 IC1.3 22.1,9.15 22.1,7.6 23.8,5.9 35.1,5.9 36.9,7.7 36.9,9.1
  Bottom 0.8: 103.3,51 103.3,52.2 | 36.9,76.5 36.9,75.5 | 36.9,10.3 36.9,9.1
DB0  (1 unrouted)
  Bottom 0.5: 9.3,71.6 15.2,71.6 16.1,70.7 17.74,70.7
  Bottom 0.8: X1.B25 9.29,71.59 9.3,71.6
DB1  (1 unrouted)
  Bottom 0.3: 6.7,72.9 9.9,72.9
  Bottom 0.5: 9.9,72.9 12.5,72.9 12.8,73.2 IC10.8
  Bottom 0.8: X1.A25 5.33,71.63 6.6,72.9 6.7,72.9
DB2  (1 unrouted)
  Bottom 0.5: 9.4,74.1 12,74.1 13.6,75.7 17.76,75.7
  Bottom 0.8: X1.B26 9.37,74.13 9.4,74.1
DB3  (1 unrouted)
  Bottom 0.3: 6.8,75.4 9.4,75.4 9.5,75.5
  Bottom 0.5: 9.5,75.5 11.6,75.5 14.4,78.3 17.76,78.3
  Bottom 0.8: X1.A26 6.6,75.4 6.8,75.4
DB4  (1 unrouted)
  Bottom 0.5: 9.4,76.7 10.9,76.7 15,80.8 IC10.5
  Bottom 0.8: X1.B27 9.37,76.67 9.4,76.7
DB5  (1 unrouted)
  Bottom 0.3: 6.7,77.9 10.2,77.9 10.8,78.5
  Bottom 0.5: 10.8,78.5 15.7,83.4 17.74,83.4
  Bottom 0.8: X1.A27 5.33,76.73 6.5,77.9 6.7,77.9
DB6  (1 unrouted)
  Bottom 0.5: 9.4,79.2 9.6,79.2 16.3,85.9 IC10.3
  Bottom 0.8: X1.B28 9.39,79.21 9.4,79.2
DB7  (1 unrouted)
  Bottom 0.3: 6.6,80.5 8.8,80.5 9.4,81.1
  Bottom 0.4: 9.4,81.1 16.7,88.4 17.76,88.4
  Bottom 0.8: X1.A28 5.33,79.23 6.6,80.5
DB'0  (2 unrouted)
  Bottom 0.5: IC21.11 45.61,27.11 46.2,27.1 | IC13.3 67.26,84.54 66,85.8 65.3,85.8 | IC10.11 35.59,68.11 46.2,57.5 46.2,55.5 | 46.2,54.3 49.8,54.3 52.4,56.9 52.4,59 65.3,71.9
  Bottom 0.8: 46.2,27.1 46.2,28.3 | 65.3,85.8 65.3,86.9 | 46.2,55.5 46.2,54.3 | 65.3,73.1 65.3,71.9
DB'1  (2 unrouted)
  Bottom 0.5: 47.4,57.6 47.4,57.8 36.1,69.1 28.9,69.1 27.4,70.6 25.46,70.6 | 47.4,24.5 47.3,24.6 44.01,24.6 IC21.12 | 47.4,56.4 48.9,56.4 49.9,57.4 49.9,59 58.6,67.7 58.6,79.1 57.3,80.4 57.3,80.7 56,82 IC12.4
  Bottom 0.8: 47.4,57.6 47.4,56.4 | 47.4,25.7 47.4,24.5
DB'2  (2 unrouted)
  Bottom 0.5: 48.6,22 44.01,22 IC21.13 | IC13.4 65.4,82 64.1,83.3 61.1,83.3 57.3,87.1 | IC10.13 27.31,73.19 30.3,70.2 36.4,70.2 45.4,61.2 47.1,61.2 48.5,59.8 | 48.5,58.7 48.5,58.9 57.3,67.6 57.3,69
  Bottom 0.8: 48.6,23.2 48.6,22 | 57.3,87.1 57.3,88.1 | 48.5,59.8 48.5,58.7 | 57.3,69 57.3,70.4
DB'3  (1 unrouted)
  Bottom 0.5: 54.83,79.5 IC12.5 56.74,79.46 57.7,78.5 57.7,73 56,71.3 56,67.6 50.9,62.5 49.2,62.5 45.5,62.5 36.9,71.1 30.8,71.1 26.17,75.73 IC10.14 | IC21.15 57.51,19.49 56.5,20.5 54,20.5 52.8,19.3 49.3,19.3 49.2,19.4
  Bottom 0.8: 49.2,19.4 49.2,20.6 | 49.2,61.3 49.2,62.5
DB'4  (1 unrouted)
  Bottom 0.25: 40.3,84.7 41.2,85.6 43.8,85.6 44.2,85.2 44.6,85.2 | 51.4,85.2 51.8,85.2 52.7,86.1 57,86.1
  Bottom 0.5: 39.2,78.2 39.9,78.9 39.9,84.3 40.3,84.7 | IC13.5 65.04,79.46 63.8,80.7 61.2,80.7 60.1,81.8 60.1,83 57,86.1 | 44.6,85.2 51.4,85.2 | IC21.16 52.27,22.03 49.8,24.5 | 39.2,78.2 39.2,70.2 45.5,63.9 49.8,63.9 | IC10.15 26.53,78.27 29.4,75.4 30.6,75.4 33.4,78.2 39.2,78.2
  Bottom 0.8: 49.8,24.5 49.8,25.7 | 49.8,63.9 49.8,65.3
DB'5  (1 unrouted)
  Bottom 0: 38.39,26.69 38.4,26.2
  Bottom 0.25: 44.6,86.1 40.5,86.1
  Bottom 0.5: IC12.2 54.71,87 52.5,87 51.6,86.1 44.6,86.1 | 40.5,86.1 40.2,86.1 38.4,84.3 38.4,82.2 | 38.4,26.2 38.4,26.6 42.7,30.9 46.3,30.9 52.6,24.6 59.19,24.6 IC21.17 | 38.4,80.9 38.2,80.7 25.52,80.7 IC10.16
  Bottom 0.8: 38.4,80.9 38.4,82.2 | 38.4,26.2 38.4,25
DB'6  (2 unrouted)
  Bottom 0.5: 51.3,90.3 52.6,91.6 57.9,91.6 61.1,88.4 63.7,88.4 64.7,89.4 66.2,89.4 68.5,87.1 68.77,87.1 IC13.2 | IC21.18 51.79,27.11 50.4,28.5 | 50.4,68 50.4,69.4 51.3,70.3 51.3,76.1 | 51.3,88.9 50.7,88.3 41.1,88.3 36.1,83.3 26,83.3 25.95,83.35 IC10.17
  Bottom 0.8: 50.4,28.5 50.4,29.7 | 50.4,66.7 50.4,68 | 51.3,88.9 51.3,90.3 | 51.3,76.1 51.3,77.2
DB'7  (3 unrouted)
  Bottom 0.5: IC21.19 53.45,29.65 51,32.1 | 54.85,84.6 55.6,84.6 58.2,82 58.2,80.9 59.5,79.6 59.5,67.4 51,58.9 51,58.5 | IC12.3 54.04,84.54 52.5,83 46.9,83 | IC10.18 25.81,85.89 25.9,85.8 36.6,85.8 39.7,88.9 39.7,90.5 41,91.8 46.9,91.8
  Bottom 0.8: 46.9,82.1 46.9,83 | 51,32.1 51,33.1 | 51,57.4 51,58.5 | 46.9,91.8 46.9,92.9
GND
  pour Bottom (isolate 0.35, rank 6): 0,100 160,100 160,0 0,0
  pour Bottom (rank 6, no thermals): 30.6,4 30.6,0 90.6,0 90.6,9 64.6,9 64.6,4
  pour Bottom (rank 6, no thermals): 3.6,99.8 10.1,99.8 10.1,96.4 3.6,96.4
  pour Top: 0,100 160,100 160,0 0,0
GND1
  pour Bottom (rank 6, no thermals): 3.6,3 9.6,3 9.6,0 3.6,0
N$1  (1 unrouted)
  Bottom 0.5: IC11.9 IC11.10 42.47,79.4 43.1,79.4 43.95,78.55 R1.1 45.25,78.5 46.6,78.5 47.1,79 48.6,79 49.6,80 | 49.6,94.2 53.3,94.2 53.5,94.4 74.9,94.4 77.9,91.4 83,91.4 84.1,92.5 132.1,92.5 135.6,89 135.6,79 137.4,77.2 137.4,76.9 | IC24.9 140.23,55 141.4,55 142.1,55.7 142.1,58.3 141.6,58.8 138.9,58.8 138.2,59.5 138.2,71.1 137.4,71.9 137.4,76.9 | IC15.9 137.42,76.92 137.4,76.9
  Bottom 0.8: 49.6,80 49.6,81 | 49.6,93.2 49.6,94.2
N$2
  Bottom 0.5: Q1.1 45.44,80.61 R1.2 44.75,80.85 43.6,82 IC11.11
N$3  (1 unrouted)
  Bottom 0.5: IC11.8 42.43,74.4 44.8,74.4 46.19,75.79 Q1.2 48.01,75.8 48.01,76.41 51.7,80.1 52.6,80.1 | 52.6,95.3 75.4,95.3 78.3,92.4 82.5,92.4 83.6,93.5 132.6,93.5 136.5,89.6 136.5,84.9 138.1,83.3 141.4,83.3 142.8,81.9 142.8,78.3 144.1,77 144.98,77 IC16.4
  Bottom 0.8: 52.6,95.3 52.6,96.6 | 52.6,81.1 52.6,80.1
N$4  (1 unrouted)
  Bottom 0.5: IC14.23 87.17,88.27 86.5,87.6 79.8,87.6 79,88.4 73,88.4 70.4,85.8 67.4,85.8 66.6,86.6 66.6,87.4 65.8,88.2 64.9,88.2 63.8,87.1 62.43,87.1
N$5
  Bottom 0.5: IC12.12 65.96,84.54 67.2,83.3 70.5,83.3 73,85.8 78.5,85.8 78.7,85.6 95.4,85.6 97.4,87.6 97.4,89.55 IC14.19
N$6
  Bottom 0.5: IC12.11 63.9,82 65.2,80.7 70.2,80.7 72.8,83.3 83,83.3 89.7,76.6 90.9,76.6 92.2,75.3 92.2,74.43 IC14.4
N$7
  Bottom 0.5: IC12.10 63.14,79.46 64.4,78.2 72.4,78.2 74.9,80.7 82.8,80.7 87.1,76.4 87.1,74.45 IC14.2
N$8
  Bottom 0.5: IC13.13 78.82,87.08 79.3,86.6 88.5,86.6 89.7,87.8 IC14.22
N$9
  Bottom 0.5: IC13.12 83.16,84.54 90.1,77.6 91.3,77.6 92.5,76.4 93.7,76.4 94.7,75.4 94.7,74.47 IC14.5
N$10
  Bottom 0.5: IC13.11 82.9,82 89.7,75.2 IC14.3
N$11
  Bottom 0.5: IC13.10 81.94,79.46 84.6,76.8 84.6,74.41 IC14.1
N$12
  Bottom 0.5: IC14.17 102.41,89.09 107.5,84 126.6,84 131.1,79.5 131.55,79.5 IC15.5
N$13  (1 unrouted)
  Bottom 0.5: IC11.2 35.78,87.08 37.4,88.7 37.4,90.4 36.1,91.7 28.8,91.7 26.8,89.7 24.1,89.7 21.4,92.4 15.2,92.4 13.5,90.7 10.4,90.7 8.4,92.7 4.5,92.7 2.3,90.5 2.3,53.9 1.4,53 1.4,10.2 3.1,8.5 13.5,8.5 17,5 35.5,5 40.2,9.7 51.8,9.7 53.6,7.9 55.6,7.9 58.7,11 80.8,11 85.9,16.1 96.8,16.1 97.1,15.8 | IC42.10 99.06,53.46 98,52.4 97.1,52.4
  Bottom 0.8: 97.1,53.2 97.1,52.4 97.1,52.1 | 97.1,15.8 97.1,14.9
N$14
  Bottom 0.5: IC42.8 100.43,48.4 101.5,48.4 103.3,46.6 114.5,46.6 116,45.1 123.9,45.1 125.9,43.1 129.9,43.1 131.2,44.4 131.2,47.8 128.4,50.6 128.4,59.2 127.8,59.8 125,59.8 121.2,63.6 118.81,63.6 IC43.1
N$15  (1 unrouted)
  Bottom 0.5: IC21.27 60.43,49.97 66.4,44 77.5,44 79.4,45.9 87.7,45.9 88.2,45.4 101.7,45.4 102.3,44.8 113.4,44.8 115.2,43 115.7,43 115.8,43.1 | IC43.2 118.62,61.08 118.6,61.1 116,61.1 115.8,60.9
  Bottom 0.8: 115.8,60.3 115.8,60.9 115.8,61.4 | 115.8,43.1 115.8,41.8
N$16
  Bottom 0.5: IC14.16 104.95,88.35 108.3,85 128.1,85 131.1,82 IC15.4
N$17
  Bottom 0.5: IC14.15 107.49,88.21 109.6,86.1 129.5,86.1 131,84.6 131.53,84.6 IC15.3
N$18
  Bottom 0.5: IC11.4 23.7,82 21.6,79.9 21.6,67.9 24.6,64.9 IC20.11
N$19
  Bottom 0.5: IC14.14 110.03,88.47 111.4,87.1 131.57,87.1 IC15.2
N$20
  Bottom 0.5: IC52.8 114.22,48.38 116.6,46 124.3,46 126.3,44 129.4,44 130.3,44.9 130.3,47.4 128.1,49.6 124.6,49.6 120.8,53.4 118.85,53.4 IC43.5
N$21
  Bottom 0.5: IC24.5 132.65,57.5 134.2,57.5 136.4,59.7 136.4,70 135.6,70.8 135.6,76.2 133.8,78 133.8,87.8 133.2,88.4 129.2,88.4 128.9,88.1 113.3,88.1 112.6,88.8 112.6,89.59 IC14.13
N$22
  Bottom 0.5: IC14.11 110.03,75.93 110.9,76.8 124.7,76.8 129.3,72.2 129.3,65.7 129.6,65.4 129.6,62.3 131.8,60.1 IC24.4
N$23
  Bottom 0.5: IC14.10 107.49,75.69 109.5,77.7 125.1,77.7 130.2,72.6 130.2,66.1 130.5,65.8 130.5,64 131.8,62.7 132.53,62.7 IC24.3
N$24
  Bottom 0.5: IC14.9 104.95,75.45 108.1,78.6 127.2,78.6 130.1,75.7 133.1,75.7 133.8,75 133.8,70 134.6,69.2 134.6,66.4 133.4,65.2 132.61,65.2 IC24.2
N$25
  Bottom 0.5: IC15.1 131.81,89.6 133.5,89.6 134.7,88.4 134.7,78.5 136.5,76.7 136.5,71.4 137.3,70.6 137.3,58.8 138.5,57.6 140.17,57.6 IC24.10
N$26
  Bottom 0.5: IC40.6 29.41,22.59 31.7,20.3 38.9,20.3 39.4,20.8 46,20.8 48.5,18.3 53.1,18.3 54.4,19.6 56.1,19.6 57.8,17.9 68.7,17.9 69.9,19.1 69.9,27.8 69,28.7 69,32.2 66.5,34.7 64.9,34.7 IC22.3
N$27
  Bottom 0.25: 56.7,85 56.1,85.6 53.3,85.6 52.8,85.1
  Bottom 0.5: 56.7,85 59.2,82.5 59.2,81.3 60.4,80.1 60.4,75.4 61.42,74.38 IC12.8 64.48,74.38 65.7,75.6 73.2,75.6 74.4,74.4 76.39,74.4 IC13.8 76.43,74.4 76.5,74.4 78.8,72.1 102.92,72.1 103.72,72.9 103.72,76.3 106.92,79.5 128.5,79.5 131.08,76.92 IC15.6 131.61,76.9 133.5,76.9 134.7,75.7 134.7,70.4 135.5,69.6 135.5,60.2 134.1,58.8 131.1,58.8 130.5,58.2 130.5,56.3 131.8,55 132.57,55 IC24.6 | 52.8,85.1 52,84.3 43.8,84.3 43.6,84.5 42.45,84.5 IC11.12
N$28
  Bottom 0.5: D1.A 143.32,36.96 R2.1 141.68,43 141.8,43 | C1.2 141.8,43 | R3.1 140.27,44.53 141.8,43
N$29  (2 unrouted)
  Bottom 0.5: IC15.10 140.74,79.46 141.6,78.6 141.6,73 140.7,72.1 | 127.3,72.1 128,72.1 128.4,71.7 128.4,64.8 128.6,64.6 128.6,62.9 128.1,62.4 124.8,62.4 122.1,65.1 116.6,65.1 115.4,63.9 115.4,62.6 113.88,61.08 113.38,61.08
  Bottom 0.8: 140.7,72.1 139.4,72.1 | 127.3,72.1 126.1,72.1
N$30
  Bottom 1: C1.1 X2.1
N$31
  Bottom 0.5: D2.A R3.2
N$32
  Bottom 0.5: IC43.6 120.28,50.92 124.3,46.9 125.7,46.9 127.1,45.5 D2.C
N$33
  Bottom 0.5: IC40.3 21.79,22.91 24.5,20.2 28.9,20.2 30.9,18.2 30.9,15.6 32.3,14.2 43.9,14.2 46,16.3 49.6,16.3 50.4,15.5 69.1,15.5 74.5,20.8 74.5,27.8 73.9,28.4 70.7,28.4 69.9,29.2 69.9,34.4 67,37.3 64.84,37.3 IC22.2
N$34  (1 unrouted)
  Bottom 0.4: 31.95,31.45 33.2,32.7 35.3,32.7 35.8,32.2
  Bottom 0.5: IC33.1 75.62,63.62 74.4,62.4 68.3,62.4 67.9,62 | 67.9,27.9 67.9,27.8 67.3,27.2 IC22.6 64,27.2 62.7,28.5 62.7,29.5 61.3,30.9 56,30.9 50.9,36 42.3,36 38.5,32.2 35.8,32.2 | IC40.10 31.95,31.45
  Bottom 0.8: 67.9,62 67.9,61 | 67.9,28.9 67.9,27.9
N$35  (1 unrouted)
  Bottom 0.5: IC33.2 76.28,61.08 75.1,59.9 68.8,59.9 68.7,59.8 | 68.7,25.5 67.9,24.7 64.84,24.7 IC22.7 64.74,24.7 63.9,24.7 61.8,26.8 61.8,27.4 60.8,28.4 53.2,28.4 50.6,31 48.2,31 45.7,33.5 42.6,33.5 37,27.9 26.6,27.9 24.33,30.17 IC40.13
  Bottom 0.8: 68.7,59.8 68.7,58.8 | 68.7,26.8 68.7,25.5
N$36
  Bottom 0.5: IC22.12 IC32.5
N$37  (2 unrouted)
  Bottom 0.5: IC41.5 92.01,29.73 C5.2 89.7,32.4 89.3,32.4 86.9,34.8 IC32.14 | IC42.3 89.86,58.54 89.7,58.4
  Bottom 0.8: 89.7,58.4 89.7,57.4 | 89.7,33.5 89.7,32.4
N$38  (1 unrouted)
  Bottom 0.5: IC32.6 80.29,27.19 81.2,28.1 | 81.2,55.2 81.2,55.3 80.5,56 | 80.5,56 IC33.4 76.7,56 74.2,58.5 72.45,58.5 IC23.12 | IC42.1 92.39,64.01 90.7,64 89.2,64 87.5,62.3 84.1,62.3 81,59.2 81,56.5 80.5,56
  Bottom 0.8: 81.2,28.1 81.2,29.2 | 81.2,54.3 81.2,55.2
N$39  (1 unrouted)
  Bottom 0.4: IC30.3 21.79,37.01 24.3,34.5 28,34.5 28.7,35.2 35.7,35.2 37.8,37.3
  Bottom 0.5: 90.6,61.8 90.88,61.08 IC42.2 | 37.8,37.3 39,38.5 47.4,38.5 48.7,39.8 56.3,39.8 57.5,41 61,41 63.4,38.6 67.1,38.6 69.7,36 74.8,36 76.15,37.35 IC32.2 82.95,37.35 84.2,36.1 87.6,36.1 90.1,38.6 90.6,38.6
  Bottom 0.8: 90.6,38.6 90.6,39.7 | 90.6,60.9 90.6,61.8
N$40  (3 unrouted)
  Bottom 0.5: IC30.6 29.41,37.91 29.61,37.91 32.3,40.6 41.9,40.6 42.4,41.1 46.8,41.1 | 46.8,14.3 50.1,14.3 50.4,14.6 79.2,14.6 82.7,18.1 82.7,28.6 | 82.7,28.6 82.7,32.5 80.4,34.8 IC32.3 | IC43.3 117.34,58.54 116.8,58 | 116.8,25.9 110.1,25.9 107.5,28.5 82.8,28.5 82.7,28.6
  Bottom 0.8: 46.8,41.1 46.8,39.7 | 46.8,15.2 46.8,14.3 | 116.8,58 116.8,57 | 116.8,26.5 116.8,25.9 116.8,25.6
N$41
  Bottom 0.5: IC43.4 116.1,56 114.8,57.3 112.2,57.3 111.7,56.8 107.9,56.8 107.4,57.3 104.4,57.3 101.9,59.8 99.1,59.8 98.2,60.7 96.1,60.7 95.1,59.8 91.3,59.8 91.1,59.6 88.1,59.6 87.9,59.8 84.7,59.8 82.3,57.4 82.3,53.6 81.8,53.1 80,53.1 79.7,53.4 78.85,53.4 IC33.5
N$42
  Bottom 0.5: IC23.2 64.71,61 59.9,61 59.1,60.2 59.1,57.6 59.7,57 61.1,57 61.4,57.3 66.1,57.3 68.7,54.7 74.1,54.7 74.8,54 74.8,52 73.72,50.92 IC23.9
N$43
  Bottom 0.5: IC51.5 IC41.12
N$44  (2 unrouted)
  Bottom 0.5: 122.1,58.6 126.25,58.6 IC43.12 | IC41.14 103.3,34.8 104.5,36.1 109.9,36.1 111.2,34.8 IC51.14 116.11,34.81 117.4,36.1 122.1,36.1
  Bottom 0.8: 122.1,36.1 122.1,37.3 | 122.1,57.7 122.1,58.6
N$45
  Bottom 0.5: IC33.8 88.02,48.38 90,46.4 102.1,46.4 102.8,45.7 113.9,45.7 115.4,44.2 123.5,44.2 125.5,42.2 130.4,42.2 130.5,42.3 | IC43.13 127.82,61.08 129.3,59.6 129.3,51 132.1,48.2 132.1,43.9 130.5,42.3 | IC53.13 126.45,37.35 126.5,37.4 132.36,37.4 C6.2 132.76,40.04 130.5,42.3
N$46  (1 unrouted)
  Bottom 0.5: 84.3,53.5 84.34,53.46 IC33.10 86.45,53.5 88.1,53.5 89.3,54.7 94.5,54.7 94.8,54.4 98.2,54.4 98.5,54.7 121,54.7 124.8,50.9 126.39,50.9 IC43.9 | IC41.7 89.65,24.65 88.4,25.9 84.4,25.9 84.3,26
  Bottom 0.8: 84.3,53.5 84.3,52.4 | 84.3,26.5 84.3,26 84.3,25.5
N$47
  Bottom 0.5: IC33.9 IC42.6 97.82,50.92 99.1,52.2 101.6,52.2 102.9,53.5 105.75,53.5 IC52.5
N$48
  Bottom 0.5: IC51.12 115.43,29.73 116.7,31 122.6,31 123.8,32.2 126.34,32.2 IC53.11
N$49  (2 unrouted)
  Bottom 0.5: IC42.5 94.04,53.46 94.3,53.2 95.8,53.2 | 95.8,33.9 98.5,33.9 98.8,33.6 103.58,33.6 104.79,34.81 IC51.3 109.59,34.81 110.9,33.5 127.8,33.5 128.7,32.6 128.7,26.9 127.7,25.9 125.1,25.9 124.2,25 124.2,21.6 123.1,20.5 117.6,20.5 114.7,23.4 109.8,23.4 109,22.6 109,15.9 106.7,13.6 95.8,13.6 94.2,15.2 86.4,15.2 81.3,10.1 59.1,10.1 56,7 53.2,7 51.7,8.5 48,8.5 | IC30.10 31.95,45.65 33.1,46.8 40.9,46.8 41.6,46.1 48,46.1
  Bottom 0.8: 95.8,33.9 95.8,35 | 95.8,52.1 95.8,53.2 | 48,46.1 48,44.8 | 48,8.5 48,7.4
N$50  (via drill 0.5 pad 2)
  other vias: 93.12,2.54
N$51  (2 unrouted)
  Bottom 0.5: IC33.12 88.06,58.54 88.2,58.4 | 89.2,41.2 94.2,41.2 96.8,38.6 103.4,38.6 104.65,37.35 IC51.2 110.15,37.35 111.4,36.1 114.9,36.1 117.4,38.6 123.6,38.6 | 89.2,41.2 88.2,41.2 | IC43.11 123.6,56 | IC30.13 24.33,44.47 27.1,41.7 30.4,41.7 31.3,42.6 40.6,42.6 41.6,43.6 63.6,43.6 68.6,38.6 88.3,38.6 89.2,39.5 89.2,41.2
  Bottom 0.8: 88.2,58.4 88.2,57.4 | 88.2,42.4 88.2,41.2 | 123.6,38.6 123.6,37.5 | 123.6,55.9 123.6,56 123.6,57
N$52  (1 unrouted)
  Bottom 0.5: IC42.4 94.9,56 95.1,55.7 | IC53.9 124.4,27.2 123.1,28.5 110.1,28.5 107.6,31 95.1,31
  Bottom 0.8: 95.1,55.7 95.1,56.9 | 95.1,30.5 95.1,31 95.1,31.8
N$53
  Bottom 0.5: IC51.6 107.2,27.2 107.9,26.5 107.9,24 107.2,23.3 104.3,23.3 103.7,22.7 103.7,20.8 100.8,17.9 85.1,17.9 80,12.8 51.4,12.8 51,12.4 29.9,12.4 28.4,10.9 28.4,7.9 27.6,7.1 25.3,7.1 24.6,7.8 IC1.4
N$54
  Bottom 0.5: IC51.7 105.74,24.6 104.2,24.6 102.7,23.1 102.7,21 100.5,18.8 84.7,18.8 79.6,13.7 50.9,13.7 50.5,13.3 31.7,13.3 29.68,15.32 IC1.9
N$55  (1 unrouted)
  Bottom 0.5: IC52.6 108.22,50.92 108.1,51 | IC42.13 102.38,61.08 103.6,62.3 108.1,62.3
  Bottom 0.8: 108.1,51 108.1,52.3 | 108.1,61.6 108.1,62.3 108.1,62.7
N$56
  Bottom 0.5: IC43.10 123.74,53.46 121,56.2 121,59 120.2,59.8 116.9,59.8 116.2,59.1 115.3,59.1 114.6,59.8 112,59.8 111.1,60.7 111.1,62.1 109.2,64 107,64 106.6,63.6 105.81,63.6 IC52.1
N$57
  Bottom 0.5: IC42.12 98.96,58.54 97.8,59.7 96.5,59.7 94.1,57.3 91.5,57.3 90.1,55.9 89,55.9 87.8,54.7 83.7,54.7 83.2,54.2 83.2,53 81.2,51 78.87,51 IC33.6
N$58  (via drill 0.5 pad 2)
  other vias: 93.12,5.08
N$59  (via drill 0.5 pad 2)
  other vias: 93.12,7.62
N$60  (via drill 0.5 pad 2)
  other vias: 95.66,2.54
N$61  (via drill 0.5 pad 2)
  other vias: 95.66,5.08
N$62  (via drill 0.5 pad 2)
  other vias: 95.66,7.62
N$63  (via drill 0.5 pad 2)
  other vias: 98.2,2.54
N$64  (via drill 0.5 pad 2)
  other vias: 98.2,5.08
N$65  (via drill 0.5 pad 2)
  other vias: 98.2,7.62
N$66  (via drill 0.5 pad 2)
  other vias: 100.74,7.62
N$67  (via drill 0.5 pad 2)
  other vias: 100.74,5.08
N$68  (via drill 0.5 pad 2)
  other vias: 100.74,2.54
N$69  (via drill 0.5 pad 2)
  other vias: 103.28,2.54
N$70  (via drill 0.5 pad 2)
  other vias: 103.28,5.08
N$71  (via drill 0.5 pad 2)
  other vias: 103.28,7.62
N$72  (via drill 0.5 pad 2)
  other vias: 105.82,7.62
N$73  (via drill 0.5 pad 2)
  other vias: 105.82,5.08
N$74  (via drill 0.5 pad 2)
  other vias: 105.82,2.54
N$75  (via drill 0.5 pad 2)
  other vias: 108.36,2.54
N$76  (via drill 0.5 pad 2)
  other vias: 108.36,5.08
N$77  (via drill 0.5 pad 2)
  other vias: 108.36,7.62
N$78  (via drill 0.5 pad 2)
  other vias: 110.9,7.62
N$79  (via drill 0.5 pad 2)
  other vias: 110.9,10.16
N$80  (via drill 0.5 pad 2)
  other vias: 110.9,5.08
N$81  (via drill 0.5 pad 2)
  other vias: 110.9,2.54
N$82  (via drill 0.5 pad 2)
  other vias: 113.44,2.54
N$83  (via drill 0.5 pad 2)
  other vias: 113.44,5.08
N$84  (via drill 0.5 pad 2)
  other vias: 113.44,7.62
N$85  (via drill 0.5 pad 2)
  other vias: 113.44,10.16
N$86  (via drill 0.5 pad 2)
  other vias: 113.44,12.7
N$87  (via drill 0.5 pad 2)
  other vias: 115.98,15.24
N$88  (via drill 0.5 pad 2)
  other vias: 115.98,12.7
N$89  (via drill 0.5 pad 2)
  other vias: 115.98,10.16
N$90  (via drill 0.5 pad 2)
  other vias: 115.98,7.62
N$91  (via drill 0.5 pad 2)
  other vias: 115.98,5.08
N$92  (via drill 0.5 pad 2)
  other vias: 115.98,2.54
N$93  (via drill 0.5 pad 2)
  other vias: 118.52,2.54
N$94  (via drill 0.5 pad 2)
  other vias: 118.52,5.08
N$95  (via drill 0.5 pad 2)
  other vias: 118.52,7.62
N$96  (via drill 0.5 pad 2)
  other vias: 118.52,10.16
N$97  (via drill 0.5 pad 2)
  other vias: 118.52,12.7
N$98  (via drill 0.5 pad 2)
  other vias: 118.52,15.24
N$99  (via drill 0.5 pad 2)
  other vias: 121.06,15.24
N$100  (via drill 0.5 pad 2)
  other vias: 121.06,12.7
N$101  (via drill 0.5 pad 2)
  other vias: 121.06,10.16
N$102  (via drill 0.5 pad 2)
  other vias: 121.06,7.62
N$103  (via drill 0.5 pad 2)
  other vias: 121.06,5.08
N$104  (via drill 0.5 pad 2)
  other vias: 121.06,2.54
N$105  (via drill 0.5 pad 2)
  other vias: 123.6,2.54
N$106  (via drill 0.5 pad 2)
  other vias: 123.6,5.08
N$107  (via drill 0.5 pad 2)
  other vias: 123.6,7.62
N$108  (via drill 0.5 pad 2)
  other vias: 123.6,10.16
N$109  (via drill 0.5 pad 2)
  other vias: 123.6,12.7
N$110  (via drill 0.5 pad 2)
  other vias: 123.6,15.24
N$111  (via drill 0.5 pad 2)
  other vias: 126.14,15.24
N$112  (via drill 0.5 pad 2)
  other vias: 126.14,12.7
N$113  (via drill 0.5 pad 2)
  other vias: 126.14,10.16
N$114  (via drill 0.5 pad 2)
  other vias: 126.14,7.62
N$115  (via drill 0.5 pad 2)
  other vias: 126.14,5.08
N$116  (via drill 0.5 pad 2)
  other vias: 126.14,2.54
N$117  (via drill 0.5 pad 2)
  other vias: 128.68,2.54
N$118  (via drill 0.5 pad 2)
  other vias: 128.68,5.08
N$119  (via drill 0.5 pad 2)
  other vias: 128.68,7.62
N$120  (via drill 0.5 pad 2)
  other vias: 128.68,10.16
N$121  (via drill 0.5 pad 2)
  other vias: 128.68,12.7
N$122  (via drill 0.5 pad 2)
  other vias: 128.68,15.24
N$123  (via drill 0.5 pad 2)
  other vias: 131.22,15.24
N$124  (via drill 0.5 pad 2)
  other vias: 131.22,12.7
N$125  (via drill 0.5 pad 2)
  other vias: 131.22,10.16
N$126  (via drill 0.5 pad 2)
  other vias: 131.22,7.62
N$127  (via drill 0.5 pad 2)
  other vias: 131.22,5.08
N$128  (via drill 0.5 pad 2)
  other vias: 131.22,2.54
N$129  (via drill 0.5 pad 2)
  other vias: 133.76,2.54
N$130  (via drill 0.5 pad 2)
  other vias: 133.76,5.08
N$131  (via drill 0.5 pad 2)
  other vias: 133.76,7.62
N$132  (via drill 0.5 pad 2)
  other vias: 133.76,10.16
N$133  (via drill 0.5 pad 2)
  other vias: 133.76,12.7
N$134  (via drill 0.5 pad 2)
  other vias: 133.76,15.24
N$135  (via drill 0.5 pad 2)
  other vias: 136.3,15.24
N$136  (via drill 0.5 pad 2)
  other vias: 136.3,12.7
N$137  (via drill 0.5 pad 2)
  other vias: 136.3,10.16
N$138  (via drill 0.5 pad 2)
  other vias: 136.3,7.62
N$139  (via drill 0.5 pad 2)
  other vias: 136.3,5.08
N$140  (via drill 0.5 pad 2)
  other vias: 136.3,2.54
N$141  (via drill 0.5 pad 2)
  other vias: 138.84,2.54
N$142  (via drill 0.5 pad 2)
  other vias: 138.84,5.08
N$143  (via drill 0.5 pad 2)
  other vias: 138.84,7.62
N$144  (via drill 0.5 pad 2)
  other vias: 138.84,10.16
N$145  (via drill 0.5 pad 2)
  other vias: 138.84,12.7
N$146  (via drill 0.5 pad 2)
  other vias: 138.84,15.24
N$147  (via drill 0.5 pad 2)
  other vias: 141.38,15.24
N$148  (via drill 0.5 pad 2)
  other vias: 141.38,12.7
N$149  (via drill 0.5 pad 2)
  other vias: 141.38,10.16
N$150  (via drill 0.5 pad 2)
  other vias: 141.38,7.62
N$151  (via drill 0.5 pad 2)
  other vias: 141.38,5.08
N$152  (via drill 0.5 pad 2)
  other vias: 141.38,2.54
N$153  (via drill 0.5 pad 2)
  other vias: 143.92,2.54
N$154  (via drill 0.5 pad 2)
  other vias: 143.92,5.08
N$155  (via drill 0.5 pad 2)
  other vias: 143.92,7.62
N$156  (via drill 0.5 pad 2)
  other vias: 143.92,10.16
N$157  (via drill 0.5 pad 2)
  other vias: 143.92,12.7
N$158  (via drill 0.5 pad 2)
  other vias: 143.92,15.24
N$159  (via drill 0.5 pad 2)
  other vias: 146.46,15.24
N$160  (via drill 0.5 pad 2)
  other vias: 146.46,12.7
N$161  (via drill 0.5 pad 2)
  other vias: 146.46,10.16
N$162  (via drill 0.5 pad 2)  (1 unrouted)
  other vias: 146.46,7.62 149,7.62
N$163  (via drill 0.5 pad 2)  (1 unrouted)
  other vias: 146.46,5.08 149,5.08
N$164  (via drill 0.5 pad 2)  (1 unrouted)
  other vias: 146.46,2.54 149,2.54
N$165  (via drill 0.5 pad 2)
  other vias: 141.38,20.32
N$166  (via drill 0.5 pad 2)
  other vias: 141.38,17.78
N$167  (via drill 0.5 pad 2)
  other vias: 138.84,17.78
N$168  (via drill 0.5 pad 2)
  other vias: 149,10.16
N$169  (via drill 0.5 pad 2)
  other vias: 149,12.7
N$170  (via drill 0.5 pad 2)
  other vias: 149,15.24
N$171  (via drill 0.5 pad 2)
  other vias: 151.54,15.24
N$172  (via drill 0.5 pad 2)
  other vias: 151.54,12.7
N$173  (via drill 0.5 pad 2)
  other vias: 151.54,10.16
N$175  (via drill 0.5 pad 2)
  other vias: 131.22,17.78
N$176  (via drill 0.5 pad 2)
  other vias: 133.76,17.78
N$177  (via drill 0.5 pad 2)
  other vias: 136.3,17.78
N$179  (via drill 0.5 pad 2)
  other vias: 133.76,20.32
N$180  (via drill 0.5 pad 2)
  other vias: 154.08,10.16
N$181  (via drill 0.5 pad 2)
  other vias: 154.08,12.7
N$182  (via drill 0.5 pad 2)
  other vias: 154.08,15.24
N$183  (via drill 0.5 pad 2)
  other vias: 151.54,30.48
N$184  (via drill 0.5 pad 2)
  other vias: 151.54,27.94
N$185  (via drill 0.5 pad 2)
  other vias: 151.54,25.4
N$186  (via drill 0.5 pad 2)
  other vias: 151.54,22.86
N$187  (via drill 0.5 pad 2)
  other vias: 151.54,20.32
N$188  (via drill 0.5 pad 2)
  other vias: 151.54,17.78
N$189  (via drill 0.5 pad 2)
  other vias: 154.08,17.78
N$190  (via drill 0.5 pad 2)
  other vias: 154.08,20.32
N$191  (via drill 0.5 pad 2)
  other vias: 154.08,22.86
N$192  (via drill 0.5 pad 2)
  other vias: 154.08,25.4
N$193  (via drill 0.5 pad 2)
  other vias: 154.08,27.94
N$194  (via drill 0.5 pad 2)
  other vias: 154.08,30.48
N$195  (via drill 0.5 pad 2)
  other vias: 146.46,30.48
N$196  (via drill 0.5 pad 2)
  other vias: 146.46,27.94
N$197  (via drill 0.5 pad 2)
  other vias: 146.46,25.4
N$198  (via drill 0.5 pad 2)
  other vias: 146.46,22.86
N$199  (via drill 0.5 pad 2)
  other vias: 146.46,20.32
N$200  (via drill 0.5 pad 2)
  other vias: 146.46,17.78
N$201  (via drill 0.5 pad 2)
  other vias: 149,17.78
N$202  (via drill 0.5 pad 2)
  other vias: 149,20.32
N$203  (via drill 0.5 pad 2)
  other vias: 149,22.86
N$204  (via drill 0.5 pad 2)
  other vias: 149,25.4
N$205  (via drill 0.5 pad 2)
  other vias: 149,27.94
N$206  (via drill 0.5 pad 2)
  other vias: 149,30.48
N$207  (via drill 0.5 pad 2)
  other vias: 143.92,17.78
N$208  (via drill 0.5 pad 2)
  other vias: 143.92,20.32
N$209  (via drill 0.5 pad 2)
  other vias: 143.92,22.86
N$210  (via drill 0.5 pad 2)
  other vias: 136.3,20.32
N$211  (via drill 0.5 pad 2)
  other vias: 138.84,20.32
N$213  (via drill 0.5 pad 2)
  other vias: 136.3,22.86
N$214  (via drill 0.5 pad 2)
  other vias: 138.84,22.86
N$215  (via drill 0.5 pad 2)
  other vias: 141.38,22.86
N$217  (via drill 0.5 pad 2)
  other vias: 138.84,25.4
N$218  (via drill 0.5 pad 2)
  other vias: 141.38,25.4
N$219  (via drill 0.5 pad 2)
  other vias: 143.92,25.4
N$220  (via drill 0.5 pad 2)
  other vias: 143.92,27.94
N$221  (via drill 0.5 pad 2)
  other vias: 141.38,27.94
N$224  (via drill 0.5 pad 2)
  other vias: 143.92,30.48
N$233  (via drill 0.5 pad 2)
  other vias: 136.3,30.48
N$234  (via drill 0.5 pad 2)
  other vias: 138.84,30.48
N$235  (via drill 0.5 pad 2)
  other vias: 141.38,30.48
N$236  (via drill 0.5 pad 2)
  other vias: 138.84,27.94
N$237  (via drill 0.5 pad 2)
  other vias: 136.3,27.94
N$238  (via drill 0.5 pad 2)
  other vias: 136.3,25.4
N$239  (via drill 0.5 pad 2)
  other vias: 133.76,30.48
N$240  (via drill 0.5 pad 2)
  other vias: 133.76,27.94
N$241  (via drill 0.5 pad 2)
  other vias: 133.76,25.4
N$242  (via drill 0.5 pad 2)
  other vias: 133.76,22.86
N$268  (via drill 0.8 pad 3)
  other vias: 155,95
N$275  (via drill 0.8 pad 3)
  other vias: 155,5
R1  (1 unrouted)
  Bottom 0: IC14.8
  Bottom 0.5: IC41.3 93.61,34.81 94.9,36.1 102.4,36.1
  Bottom 0.8: 102.4,35.9 102.4,36.1 102.4,36.8
R2  (2 unrouted)
  Bottom 0.5: IC33.13 88.88,61.08 88.9,60.9 | 88.9,35.7 90.5,37.3 92.64,37.3 IC41.2 | IC14.7 99.87,76.13 98.6,77.4 96.1,77.4 | 88.9,62.1 88.9,62.2 89.8,63.1 90.9,63.1 91.6,62.4 96.1,62.4
  Bottom 0.8: 88.9,60.9 88.9,62.1 | 88.9,34.8 88.9,35.7 | 96.1,77.4 96.1,78.5 | 96.1,62.4 96.1,63.7
R4  (2 unrouted)
  Bottom 0.5: IC52.4 103.6,56 102.3,57.3 99,57.3 98.3,58 97.3,58 | IC41.6 96.19,27.19 96.5,26.8 | 97.3,57.6 97.2,57.6 96.5,56.9
  Bottom 0.8: 97.3,57.6 97.3,58 97.3,58.6 | 96.5,56.9 96.5,55.7 | 96.5,27.1 96.5,26.8 96.5,25.9
SYNC  (1 unrouted)
  Bottom 0.5: IC42.11 98.4,56 97.9,56.5 | 97.9,12.6 98,12.7 107.1,12.7 113.1,18.7 124,18.7 130.5,25.2 130.5,31.7 133.8,35 D1.C
  Bottom 0.8: 97.9,56.5 97.9,55.7 | 97.9,12.6 97.9,11.6
T  (4 unrouted)
  Bottom 0.5: IC11.13 51.18,87.08 52.5,88.4 56.1,88.4 57.1,89.4 58.3,89.4 60.3,87.4 | IC16.13 151.32,76.92 150.5,76.1 150.5,72.7 | 150.5,72.7 151.4,71.8 152.64,71.8 IC16.11 | 60.3,58.5 64.75,58.5 IC23.3 64.83,58.5 66.9,58.5 67,58.4 67,58.2 69.2,56 IC23.11 | IC22.5 66.73,29.73 67,30 | 150.5,72.7 149.3,72.7 147.2,70.6 140.6,70.6 | 126.1,70.6 67.1,70.6 | 67.1,63.4 67.1,63 66.7,62.6 66.7,59.8 67,59.5
  Bottom 0.8: 60.3,87.4 60.3,86.3 | 60.3,59.5 60.3,58.5 | 67,30 67,31.3 | 67,58.2 67,59.5 | 140.6,70.6 139.4,70.6 | 127.3,70.6 126.1,70.6 | 67.1,70.6 67.1,69.4 | 67.1,64.4 67.1,63.4
ZR
  Bottom 0.5: IC52.9 112.12,50.92 110.9,49.7 98.8,49.7 98.2,49.1 94.9,49.1 94.3,49.7 68.8,49.7 67.6,50.9 64.81,50.9 IC23.6

### Text on the board
bRestrict: B A | redesign 2020 by ferryTALE | B A | KRAMER MC / BS1K